# EAGLE design main_v3-przed_kompresja (EAGLE 5.10)
TME: 1206YC106KAT2A

## Sheet 1 of 6
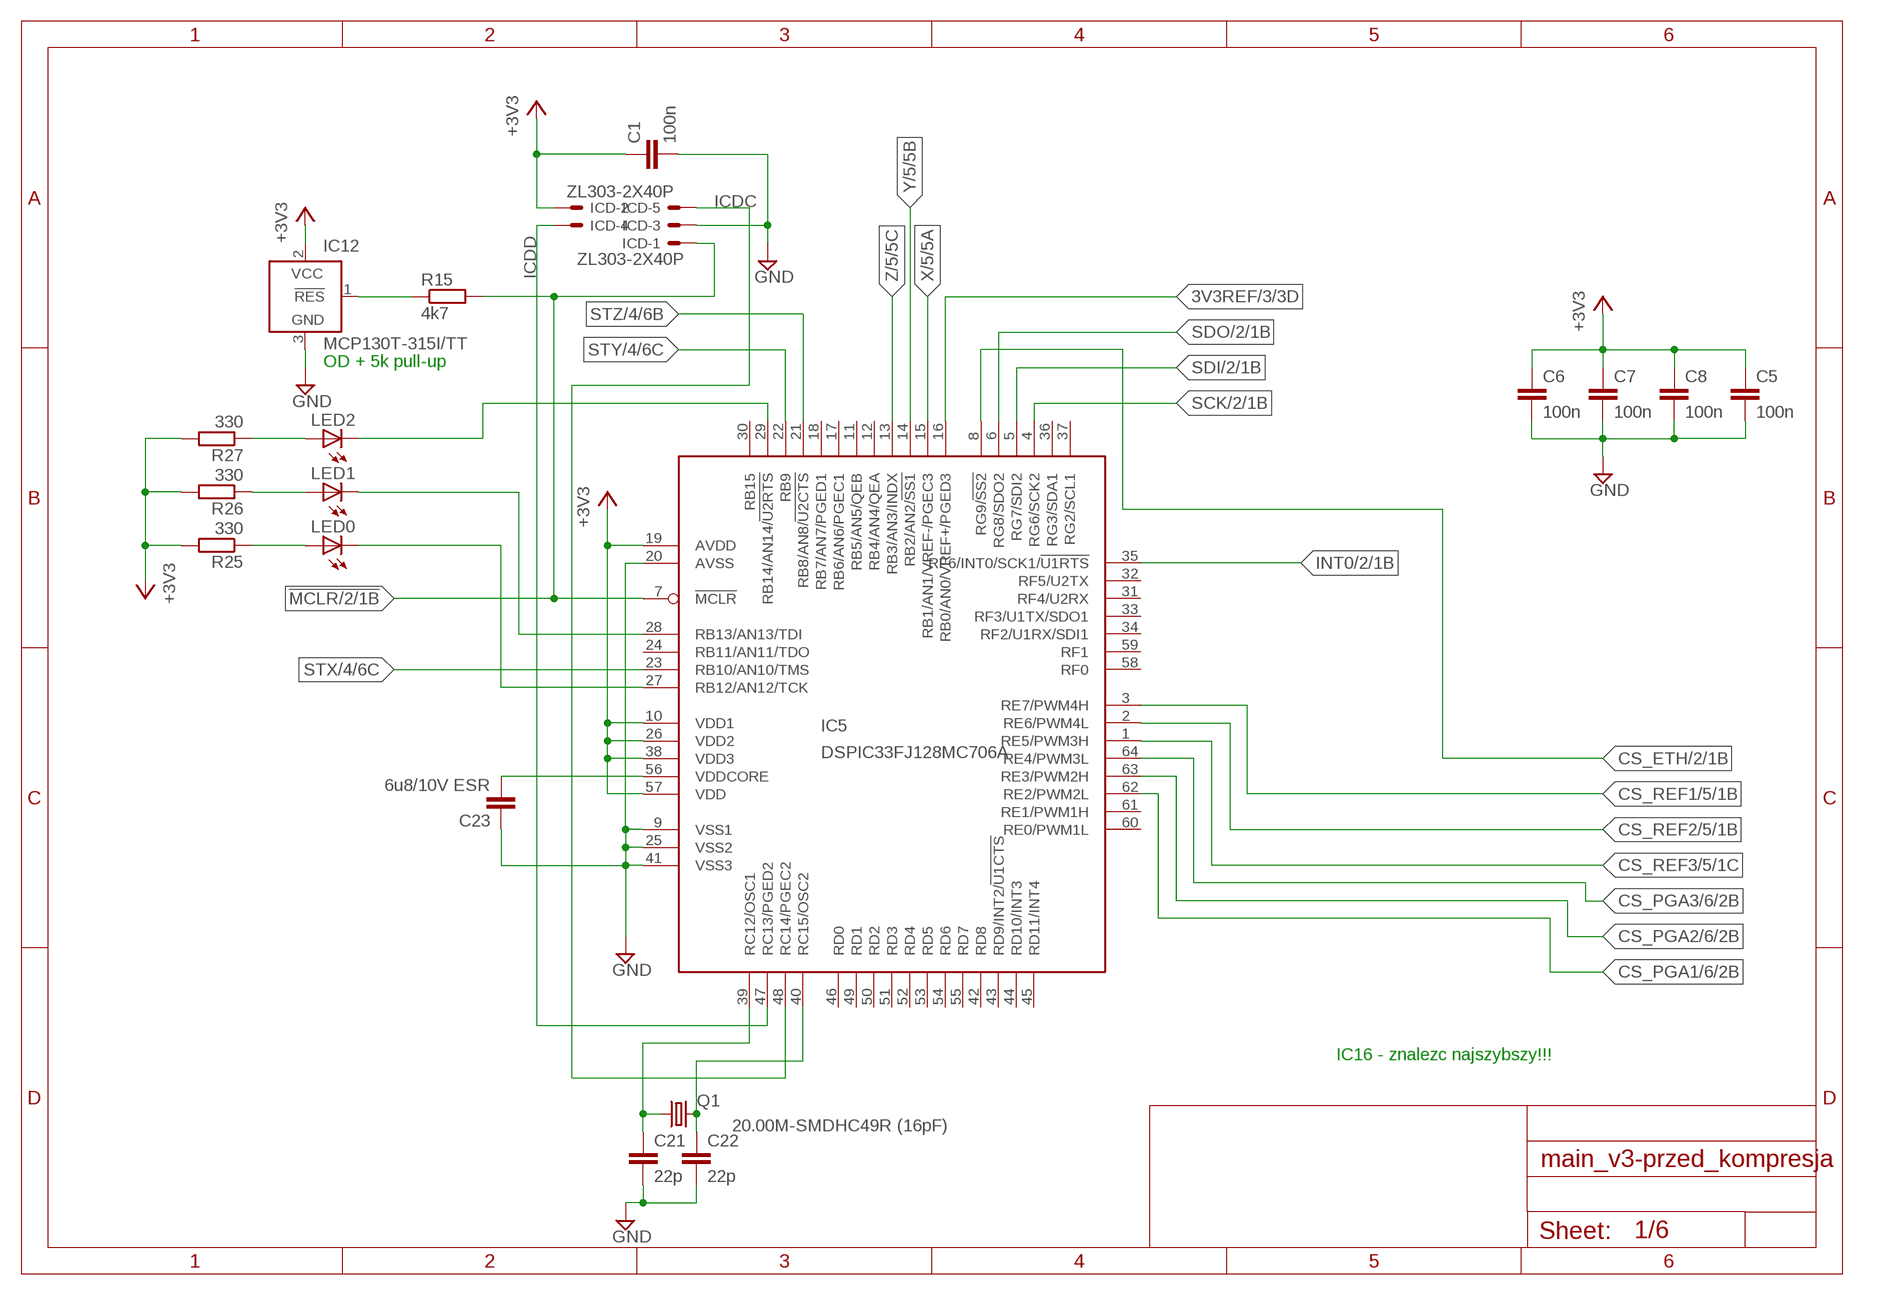
[diagram p0: schematic, sheet 1]

### Parts
C1  100n  C-EUC0805  [C0805]
C5  100n  C-EUC0805  [C0805]
C6  100n  C-EUC0805  [C0805]
C7  100n  C-EUC0805  [C0805]
C8  100n  C-EUC0805  [C0805]
C21  22p  C-EUC0805  [C0805]
C22  22p  C-EUC0805  [C0805]
C23  6u8/10V ESR  C-EUC1210  [C1210]
IC5  DSPIC33FJ128MC706A  DSPIC33FJ128MC706  [TQFP64_10X10]
IC12  MCP130T-315I/TT  MCP10T  [SOT23B-3]
ICD  ZL303-2X40P  87758-0616  [87758-0616]
LED0  LEDCHIPLED_1206  [CHIPLED_1206]
LED1  LEDCHIPLED_1206  [CHIPLED_1206]
LED2  LEDCHIPLED_1206  [CHIPLED_1206]
Q1  20.00M-SMDHC49R (16pF)  CRYSTALHC49UP  [HC49UP]
R15  4k7  R-EU_R0805  [R0805]
R25  330  R-EU_R0805  [R0805]
R26  330  R-EU_R0805  [R0805]
R27  330  R-EU_R0805  [R0805]

### Nets
3V3REF: IC5.16(RB0/AN0/VREF+/PGED3) ; also sheet 3
!MCLR: IC5.7(!MCLR) ICD.1 R15.2 ; also sheet 2
+3V3: C1.1 C5.1 C6.1 C7.1 C8.1 IC5.10(VDD1) IC5.19(AVDD) IC5.26(VDD2) IC5.38(VDD3) IC5.57(VDD) IC12.2(VCC) ICD.2 R25.2 R26.2 R27.2 ; also sheet 2,3,5
CS_ETH: IC5.8(RG9/!SS2) ; also sheet 2
CS_PGA1: IC5.62(RE2/PWM2L) ; also sheet 6
CS_PGA2: IC5.63(RE3/PWM2H) ; also sheet 6
CS_PGA3: IC5.64(RE4/PWM3L) ; also sheet 6
CS_REF1: IC5.3(RE7/PWM4H) ; also sheet 5
CS_REF2: IC5.2(RE6/PWM4L) ; also sheet 5
CS_REF3: IC5.1(RE5/PWM3H) ; also sheet 5
GND: C1.2 C5.2 C6.2 C7.2 C8.2 C21.2 C22.2 C23.1 IC5.9(VSS1) IC5.20(AVSS) IC5.25(VSS2) IC5.41(VSS3) IC12.3(GND) ICD.3 ; also sheet 2,3,6
ICDC: IC5.48(RC14/PGEC2) ICD.5
ICDD: IC5.47(RC13/PGED2) ICD.4
INT0: IC5.35(RF6/INT0/SCK1/!U1RTS) ; also sheet 2
LED0: IC5.27(RB12/AN12/TCK) LED0.C
LED1: IC5.28(RB13/AN13/TDI) LED1.C
LED2: IC5.29(RB14/AN14/!U2RTS) LED2.C
N$46: C23.2 IC5.56(VDDCORE)
N$47: IC12.1(!RES) R15.1
N$48: C22.1 IC5.40(RC15/OSC2) Q1.2
N$49: C21.1 IC5.39(RC12/OSC1) Q1.1
N$60: LED0.A R25.1
N$61: LED1.A R26.1
N$62: LED2.A R27.1
SCK: IC5.4(RG6/SCK2) ; also sheet 2,5,6
SDI: IC5.5(RG7/SDI2) ; also sheet 2
SDO: IC5.6(RG8/SDO2) ; also sheet 2,5,6
STX: IC5.23(RB10/AN10/TMS) ; also sheet 4
STY: IC5.22(RB9) ; also sheet 4
STZ: IC5.21(RB8/AN8/!U2CTS) ; also sheet 4
X: IC5.15(RB1/AN1/VREF-/PGEC3) ; also sheet 5
Y: IC5.14(RB2/AN2/!SS1) ; also sheet 5
Z: IC5.13(RB3/AN3/INDX) ; also sheet 5
Unconnected: IC5.11(RB5/AN5/QEB) IC5.12(RB4/AN4/QEA) IC5.17(RB6/AN6/PGEC1) IC5.18(RB7/AN7/PGED1) IC5.24(RB11/AN11/TDO) IC5.30(RB15) IC5.31(RF4/U2RX) IC5.32(RF5/U2TX) IC5.33(RF3/U1TX/SDO1) IC5.34(RF2/U1RX/SDI1) IC5.36(RG3/SDA1) IC5.37(RG2/SCL1) IC5.42(RD8) IC5.43(RD9/INT2/!U1CTS) IC5.44(RD10/INT3) IC5.45(RD11/INT4) IC5.46(RD0) IC5.49(RD1) IC5.50(RD2) IC5.51(RD3) IC5.52(RD4) IC5.53(RD5) IC5.54(RD6) IC5.55(RD7) IC5.58(RF0) IC5.59(RF1) IC5.60(RE0/PWM1L) IC5.61(RE1/PWM1H) ICD.6

### Notes on the sheet
- OD + 5k pull-up
- IC16 - znalezc najszybszy!!!

## Sheet 2 of 6
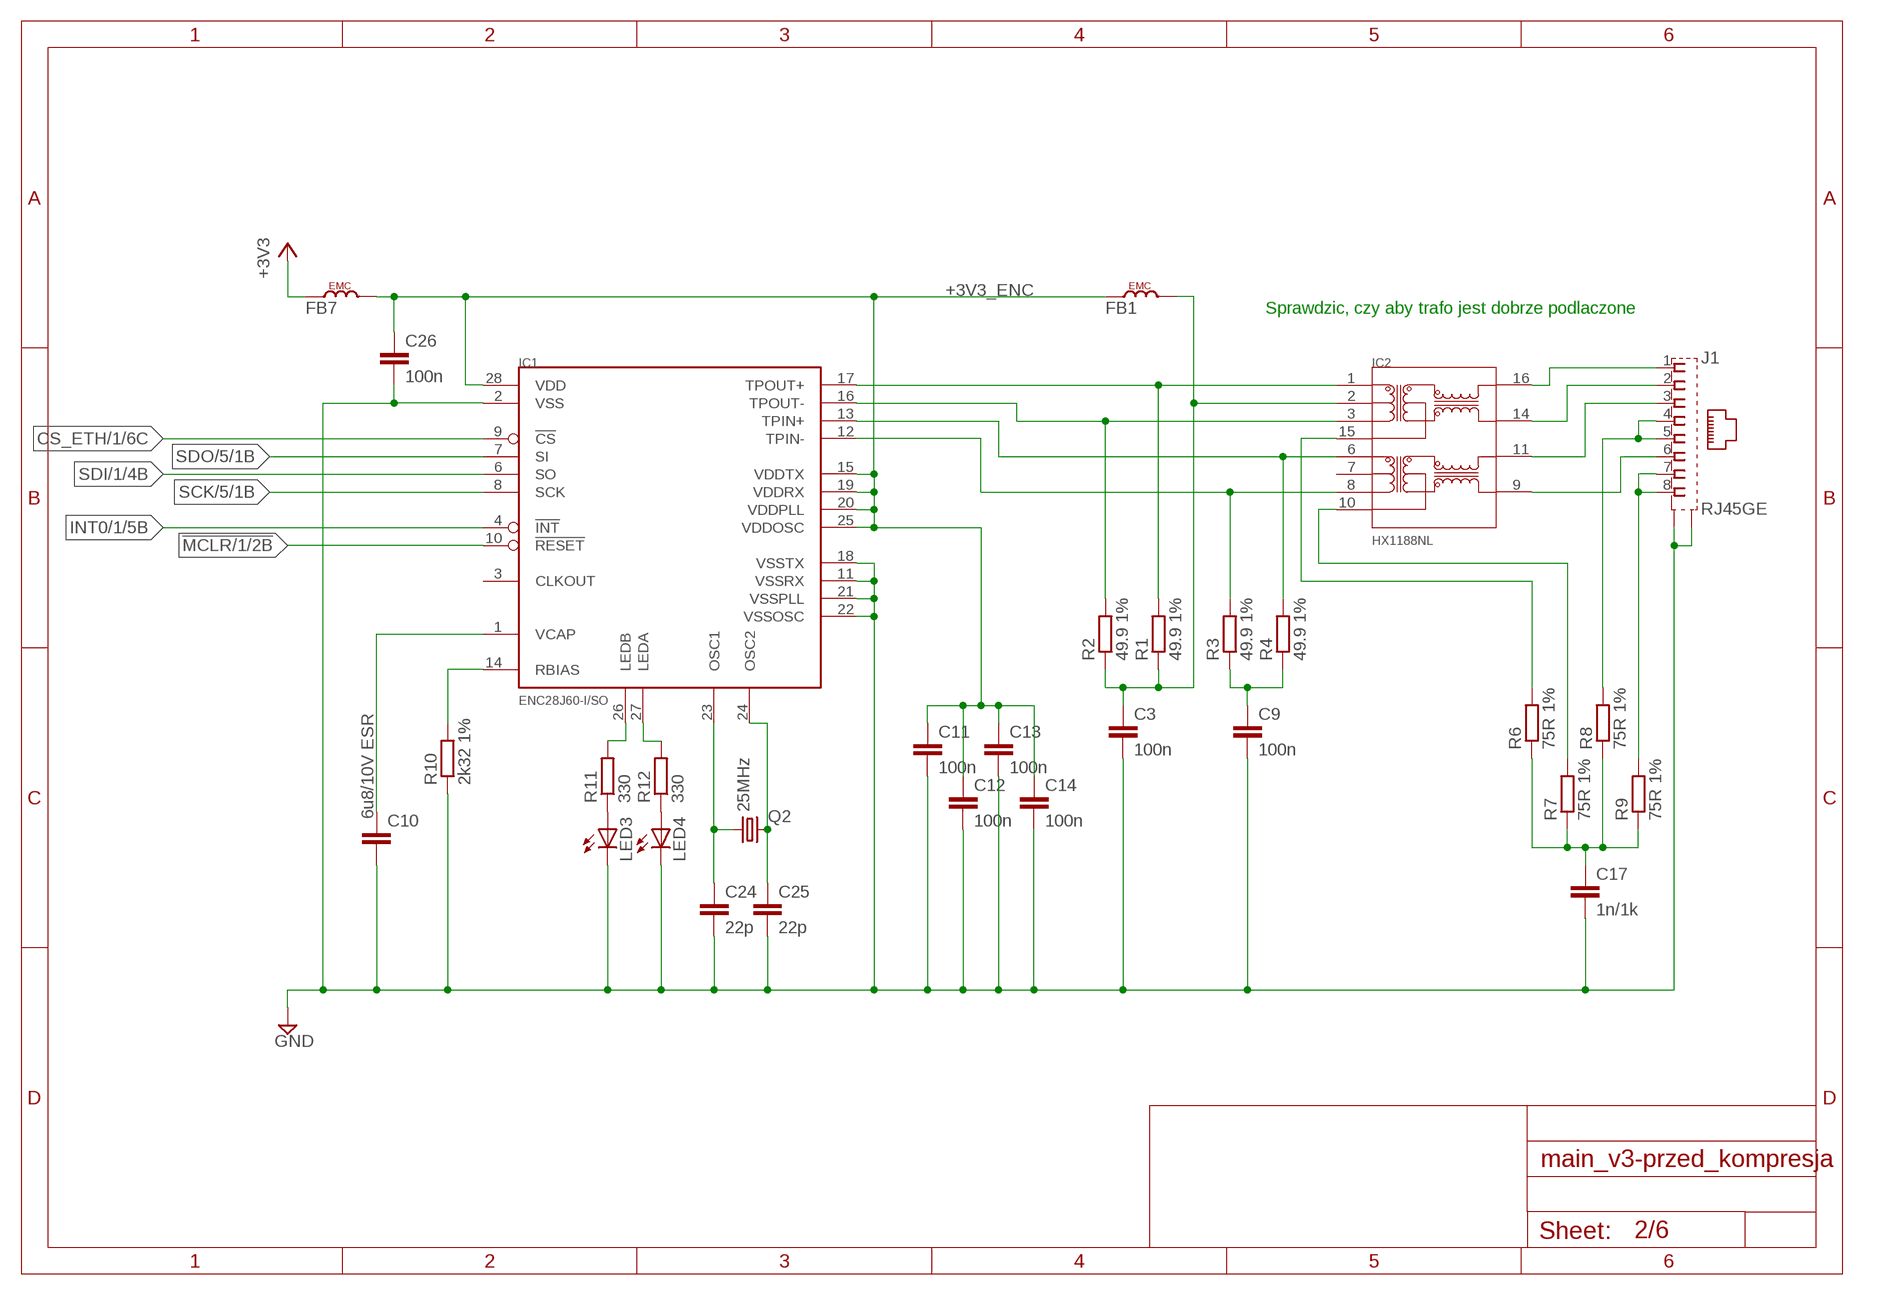
[diagram p1: schematic, sheet 2]

### Parts
C3  100n  C-EUC0805  [C0805]
C9  100n  C-EUC0805  [C0805]
C10  6u8/10V ESR  C-EUC1210  [C1210]
C11  100n  C-EUC0805  [C0805]
C12  100n  C-EUC0805  [C0805]
C13  100n  C-EUC0805  [C0805]
C14  100n  C-EUC0805  [C0805]
C17  1n/1k  C-EUC0805  [C0805]
C24  22p  C-EUC0805  [C0805]
C25  22p  C-EUC0805  [C0805]
C26  100n  C-EUC0805  [C0805]
FB1  FERRITE_BEAD0805  [R0805]
FB7  FERRITE_BEAD0805  [R0805]
IC1  ENC28J60-I/SO  [SO28W]
IC2  HX1188NL  [TRAFO_H*NL]
J1  RJ45GE  555153-1  [555153-1]
LED3  LEDCHIPLED_1206  [CHIPLED_1206]
LED4  LEDCHIPLED_1206  [CHIPLED_1206]
Q2  25MHz  CRYSTALHC49UP  [HC49UP]
R1  49.9 1%  R-EU_M0805  [M0805]
R2  49.9 1%  R-EU_M0805  [M0805]
R3  49.9 1%  R-EU_M0805  [M0805]
R4  49.9 1%  R-EU_M0805  [M0805]
R6  75R 1%  R-EU_R0805  [R0805]
R7  75R 1%  R-EU_R0805  [R0805]
R8  75R 1%  R-EU_R0805  [R0805]
R9  75R 1%  R-EU_R0805  [R0805]
R10  2k32 1%  R-EU_R1206  [R1206]
R11  330  R-EU_R0805  [R0805]
R12  330  R-EU_R0805  [R0805]

### Nets
!MCLR: IC1.10(!RESET) ; also sheet 1
+3V3: FB7.1 ; also sheet 1,3,5
+3V3_ENC: C11.1 C12.1 C13.1 C14.1 C26.1 FB1.1 FB7.2 IC1.15(VDDTX) IC1.19(VDDRX) IC1.20(VDDPLL) IC1.25(VDDOSC) IC1.28(VDD)
CS_ETH: IC1.9(!CS) ; also sheet 1
GND: C3.2 C9.2 C10.2 C11.2 C12.2 C13.2 C14.2 C17.2 C24.2 C25.2 C26.2 IC1.2(VSS) IC1.11(VSSRX) IC1.18(VSSTX) IC1.21(VSSPLL) IC1.22(VSSOSC) J1.G1(S1) J1.G2(S2) LED3.C LED4.C R10.1 ; also sheet 1,3,6
INT0: IC1.4(!INT) ; also sheet 1
N$5: IC2.15 R6.2
N$6: C3.1 FB1.2 IC2.2 R1.1 R2.1
N$7: IC2.10 R7.2
N$8: C9.1 R3.1 R4.1
N$9: C17.1 R6.1 R7.1 R8.1 R9.1
N$14: J1.4 J1.5 R8.2
N$15: J1.7 J1.8 R9.2
N$16: C25.1 IC1.24(OSC2) Q2.2
N$17: C24.1 IC1.23(OSC1) Q2.1
N$18: IC1.14(RBIAS) R10.2
N$19: C10.1 IC1.1(VCAP)
N$22: LED3.A R11.1
N$23: LED4.A R12.1
N$24: IC1.26(LEDB) R11.2
N$25: IC1.27(LEDA) R12.2
SCK: IC1.8(SCK) ; also sheet 1,5,6
SDI: IC1.6(SO) ; also sheet 1
SDO: IC1.7(SI) ; also sheet 1,5,6
TPIN+1: IC1.13(TPIN+) IC2.6 R4.2
TPIN+2: IC2.11 J1.3
TPIN-1: IC1.12(TPIN-) IC2.8 R3.2
TPIN-2: IC2.9 J1.6
TPOUT+1: IC1.17(TPOUT+) IC2.1 R1.2
TPOUT+2: IC2.16 J1.1
TPOUT-1: IC1.16(TPOUT-) IC2.3 R2.2
TPOUT-2: IC2.14 J1.2
Unconnected: IC1.3(CLKOUT) IC2.7

### Notes on the sheet
- Sprawdzic, czy aby trafo jest dobrze podlaczone

## Sheet 3 of 6
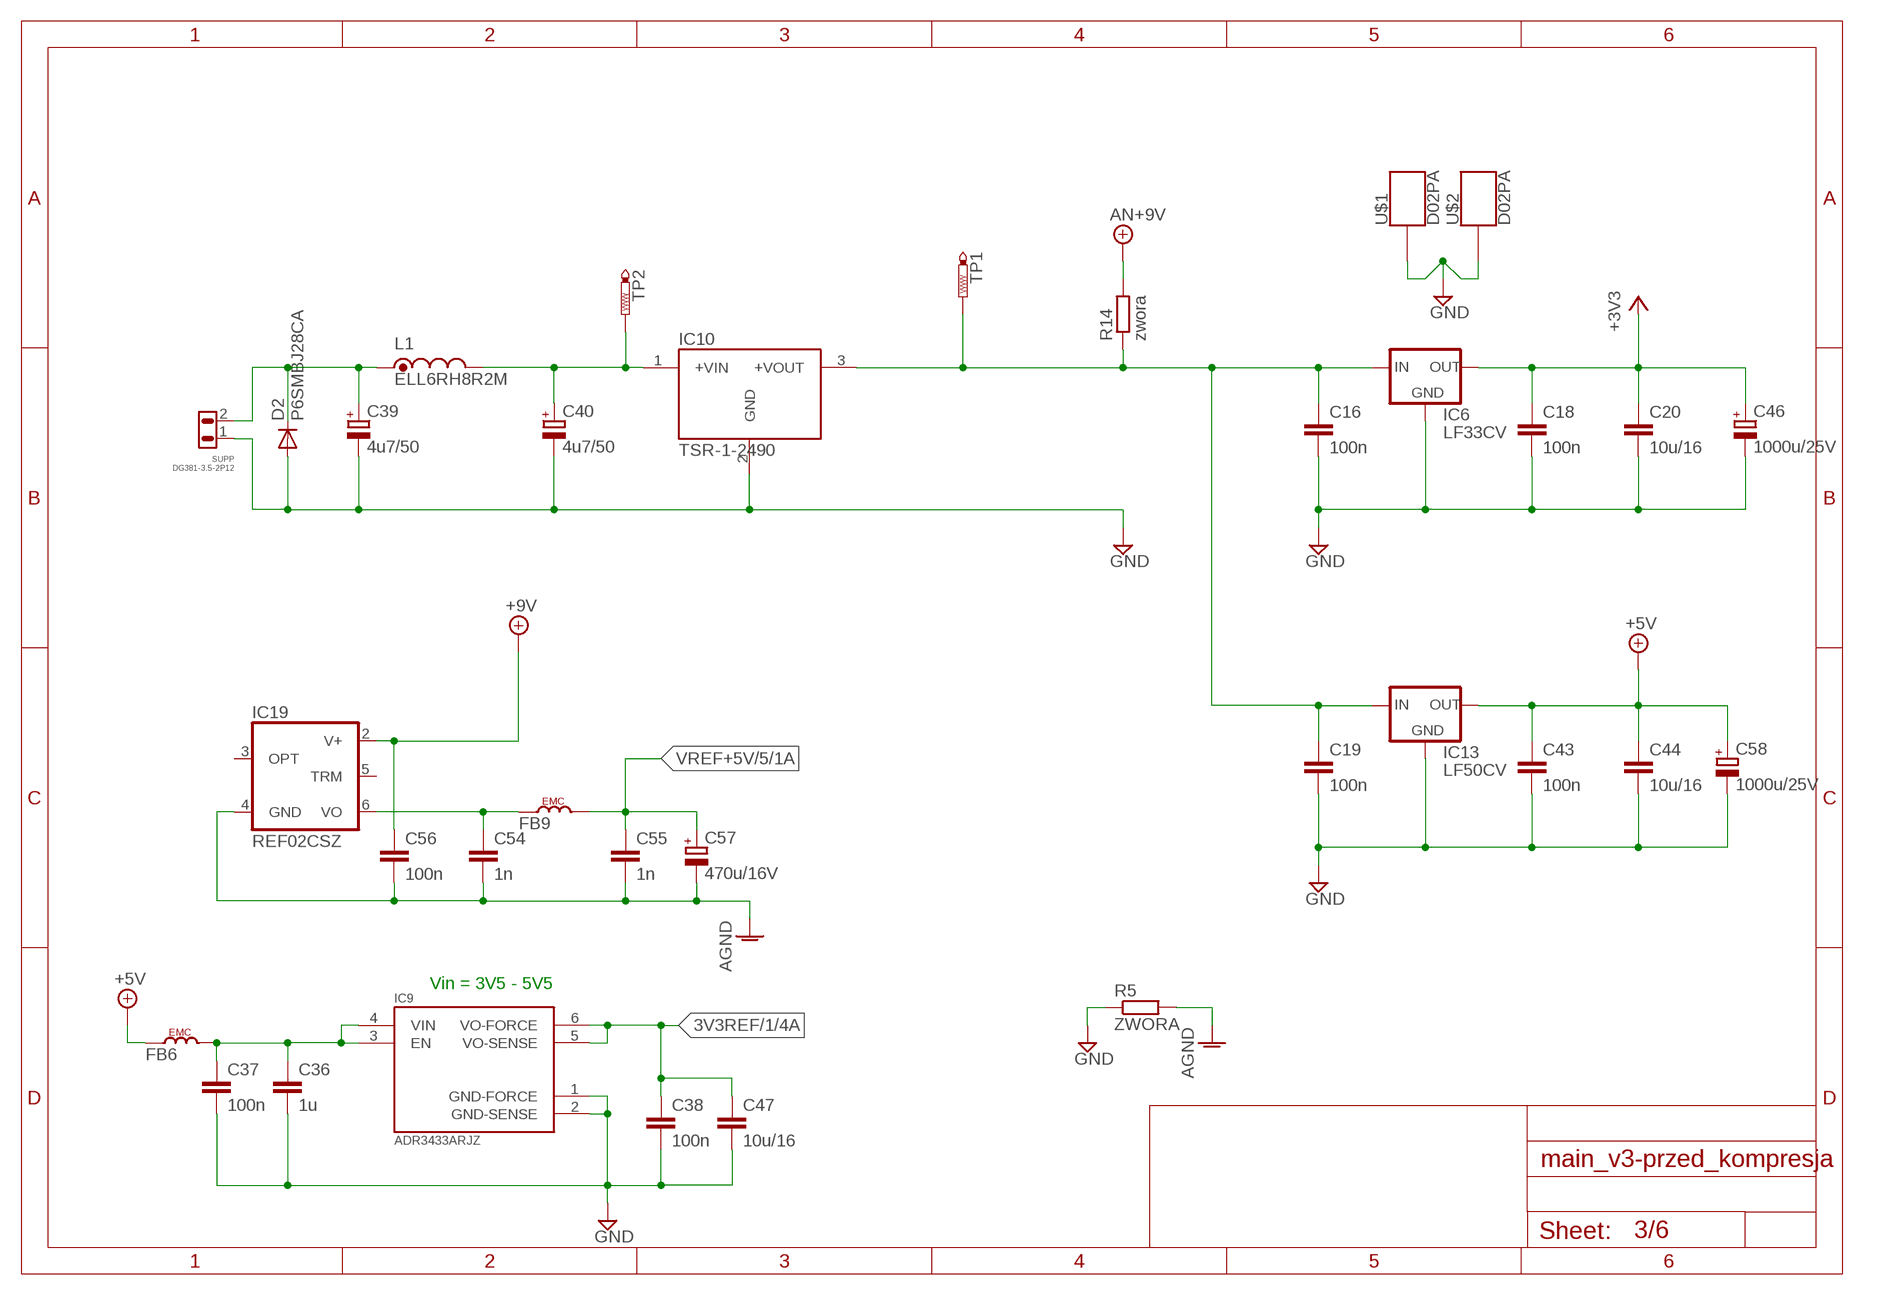
[diagram p2: schematic, sheet 3]

### Parts
C16  100n  C-EUC0805  [C0805]
C18  100n  C-EUC0805  [C0805]
C19  100n  C-EUC0805  [C0805]
C20  10u/16  C-EUC1206K  [C1206K]
C36  1u  C-EUC1206  [C1206]
C37  100n  C-EUC0805  [C0805]
C38  100n  C-EUC0805  [C0805]
C39  4u7/50  CPOL-EUUD-5X5,8  [UD-5X5,8_NICHICON]
C40  4u7/50  CPOL-EUUD-5X5,8  [UD-5X5,8_NICHICON]
C43  100n  C-EUC0805  [C0805]
C44  10u/16  C-EUC1206K  [C1206K]
C46  1000u/25V  CPOL-EUTT5D10  [TT5D10]
C47  10u/16  C-EUC1206K  [C1206K]
C54  1n  C-EUC0805  [C0805]
C55  1n  C-EUC0805  [C0805]
C56  100n  C-EUC0805  [C0805]
C57  470u/16V  CPOL-EUE3.5-8  [E3,5-8]
C58  1000u/25V  CPOL-EUTT5D10  [TT5D10]
D2  P6SMBJ28CA  DIODE-DO214AA  [DO214AA]
FB6  FERRITE_BEAD0805  [R0805]
FB9  FERRITE_BEAD0805  [R0805]
IC6  LF33CV  78XXS  [78XXS]
IC9  ADR3433ARJZ  [SOT23-6]
IC10  TSR-1-2490  [TSR1]
IC13  LF50CV  78XXS  [78XXS]
IC19  REF02CSZ  REF02D  [SO08]
L1  ELL6RH8R2M  [L_PKG_60X60]
R5  ZWORA  R-EU_M1206  [M1206]
R14  zwora  R-EU_M1206  [M1206]
SUPP  DG381-3.5-2P12  DG318-3.5-2P  [DG381X2-3.5]
TP1  PTR1PAD1-13  [P1-13]
TP2  PTR1PAD1-13  [P1-13]
U$1  D02PA  [D02PA]
U$2  D02PA  [D02PA]

### Nets
3V3REF: C38.1 C47.1 IC9.5(VO-SENSE) IC9.6(VO-FORCE) ; also sheet 1
+3V3: C18.1 C20.1 C46.+ IC6.OUT ; also sheet 1,2,5
+5V: C43.1 C44.1 C58.+ FB6.1 IC13.OUT ; also sheet 5
AGND: C54.2 C55.2 C56.2 C57.- IC19.4(GND) R5.2 ; also sheet 4,5
AN+9V: C56.1 IC19.2(V+) R14.2 ; supply symbol labelled +9V ; also sheet 4
GND: C16.2 C18.2 C19.2 C20.2 C36.2 C37.2 C38.2 C39.- C40.- C43.2 C44.2 C46.- C47.2 C58.- D2.A IC6.GND IC9.1(GND-FORCE) IC9.2(GND-SENSE) IC10.2(GND) IC13.GND R5.1 SUPP.1 U$1.P$1 U$2.P$1 ; also sheet 1,2,6
N$12: C36.1 C37.1 FB6.2 IC9.3(EN) IC9.4(VIN)
N$13: C54.1 FB9.1 IC19.6(VO)
N$30: C16.1 C19.1 IC6.IN IC10.3(+VOUT) IC13.IN R14.1 TP1.TP
N$35: C40.+ IC10.1(+VIN) L1.2(OUT) TP2.TP
N$41: C39.+ D2.C L1.1(IN) SUPP.2
VREF+5V: C55.1 C57.+ FB9.2 ; also sheet 5
Unconnected: IC19.3(OPT) IC19.5(TRM)

### Notes on the sheet
- Vin = 3V5 - 5V5

## Sheet 4 of 6
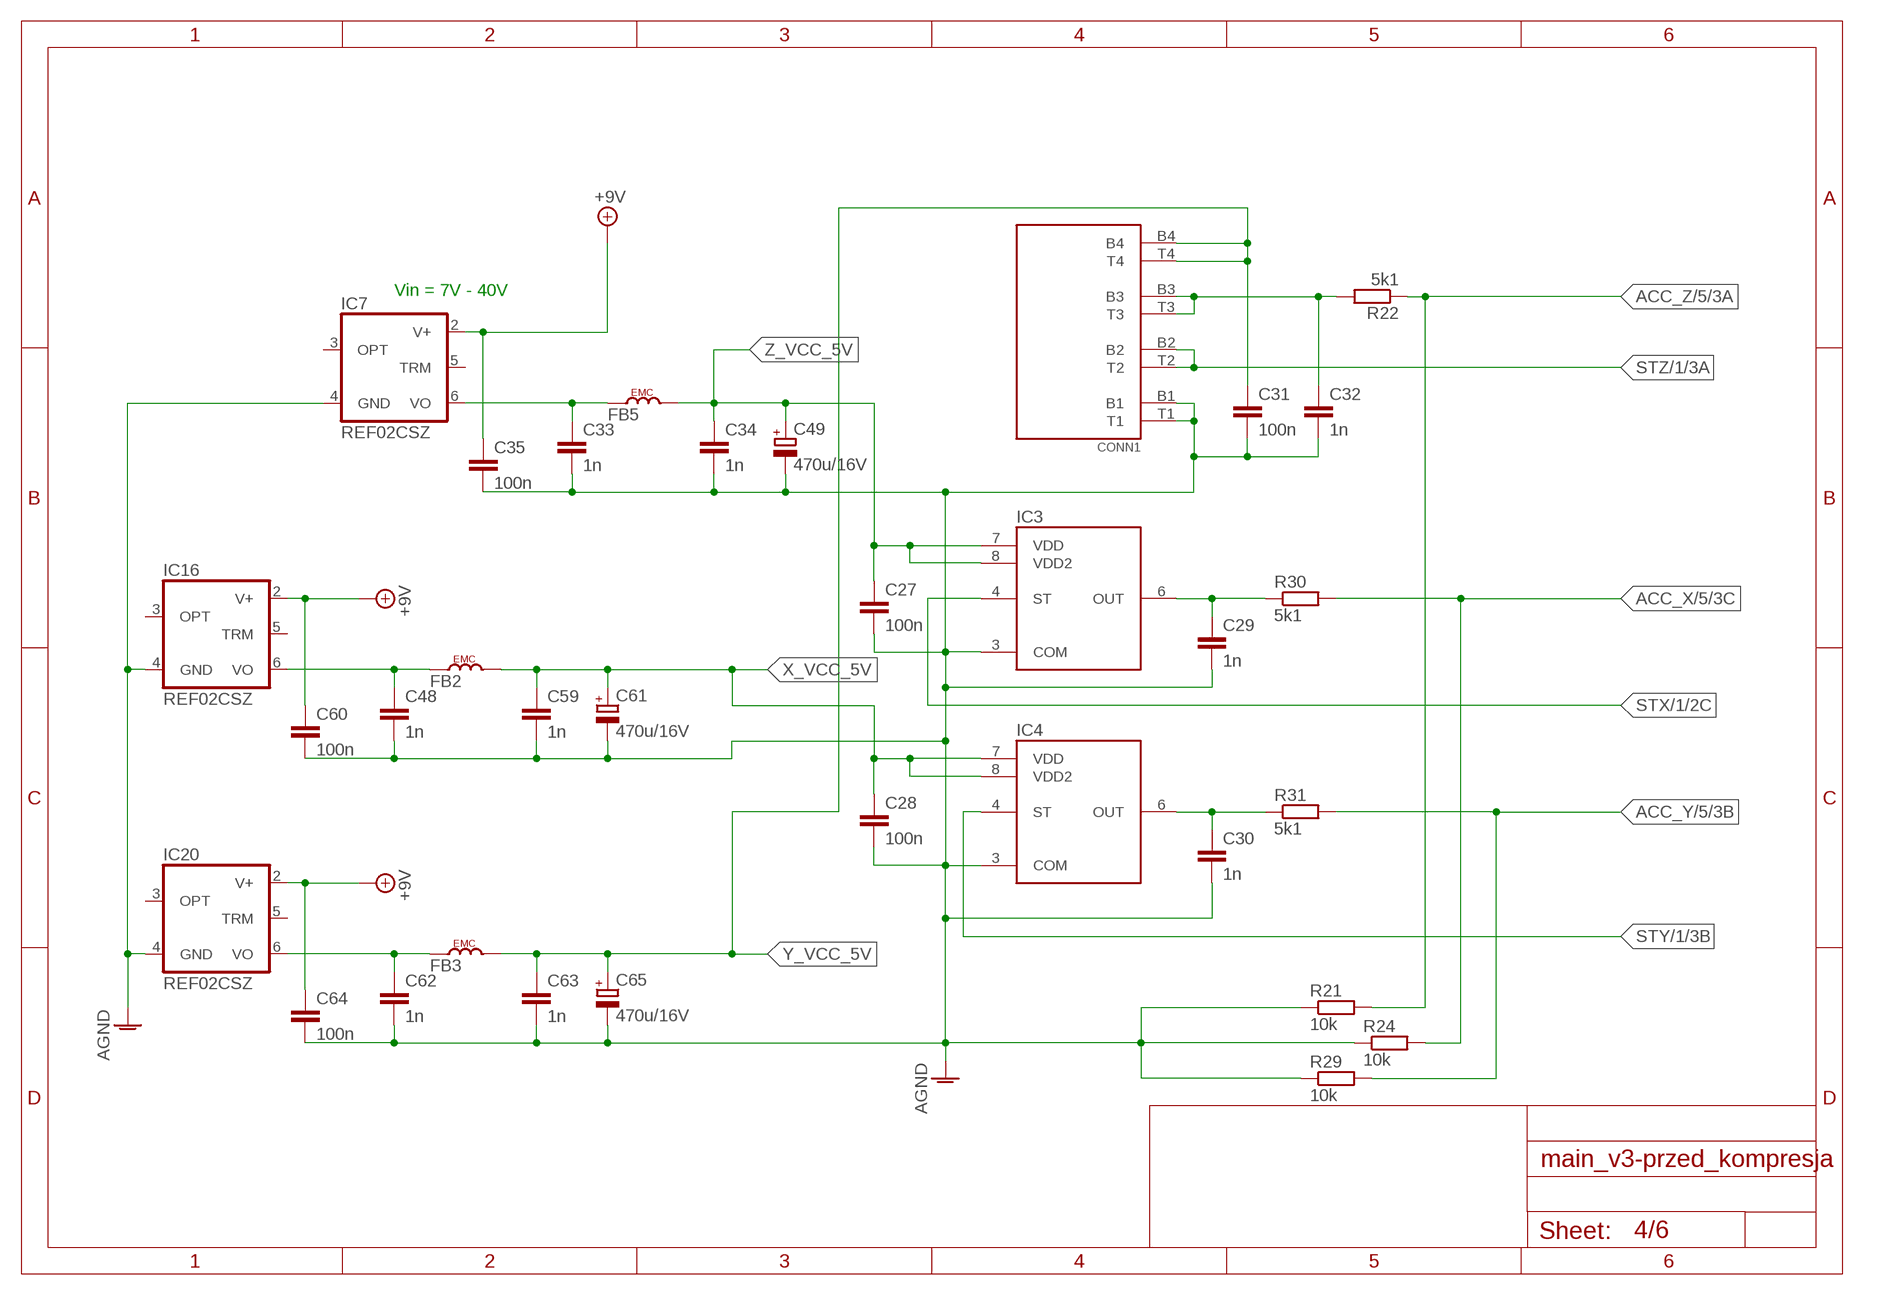
[diagram p3: schematic, sheet 4]

### Parts
C27  100n  C-EUC0805  [C0805]
C28  100n  C-EUC0805  [C0805]
C29  1n  C-EUC0805  [C0805]
C30  1n  C-EUC0805  [C0805]
C31  100n  C-EUC0805  [C0805]
C32  1n  C-EUC0805  [C0805]
C33  1n  C-EUC0805  [C0805]
C34  1n  C-EUC0805  [C0805]
C35  100n  C-EUC0805  [C0805]
C48  1n  C-EUC0805  [C0805]
C49  470u/16V  CPOL-EUE3.5-8  [E3,5-8]
C59  1n  C-EUC0805  [C0805]
C60  100n  C-EUC0805  [C0805]
C61  470u/16V  CPOL-EUE3.5-8  [E3,5-8]
C62  1n  C-EUC0805  [C0805]
C63  1n  C-EUC0805  [C0805]
C64  100n  C-EUC0805  [C0805]
C65  470u/16V  CPOL-EUE3.5-8  [E3,5-8]
CONN1  GNIAZDO4  [GNIAZDO]
FB2  FERRITE_BEAD0805  [R0805]
FB3  FERRITE_BEAD0805  [R0805]
FB5  FERRITE_BEAD0805  [R0805]
IC3  ADXL001-70L  [LCC8_LONG]
IC4  ADXL001-70L  [LCC8_LONG]
IC7  REF02CSZ  REF02D  [SO08]
IC16  REF02CSZ  REF02D  [SO08]
IC20  REF02CSZ  REF02D  [SO08]
R21  10k  R-EU_M0805  [M0805]
R22  5k1  R-EU_M0805  [M0805]
R24  10k  R-EU_M0805  [M0805]
R29  10k  R-EU_M0805  [M0805]
R30  5k1  R-EU_M0805  [M0805]
R31  5k1  R-EU_M0805  [M0805]

### Nets
ACC_X: R24.2 R30.2 ; also sheet 5
ACC_Y: R29.2 R31.2 ; also sheet 5
ACC_Z: R21.2 R22.1 ; also sheet 5
AGND: C27.2 C28.2 C29.2 C30.2 C31.2 C32.2 C33.2 C34.2 C35.2 C48.2 C49.- C59.2 C60.2 C61.- C62.2 C63.2 C64.2 C65.- CONN1.B1 CONN1.T1 IC3.3(COM) IC4.3(COM) IC7.4(GND) IC16.4(GND) IC20.4(GND) R21.1 R24.1 R29.1 ; also sheet 3,5
AN+9V: C35.1 C60.1 C64.1 IC7.2(V+) IC16.2(V+) IC20.2(V+) ; supply symbol labelled +9V ; also sheet 3
N$3: C48.1 FB2.1 IC16.6(VO)
N$4: C62.1 FB3.1 IC20.6(VO)
N$26: C29.1 IC3.6(OUT) R30.1
N$27: C30.1 IC4.6(OUT) R31.1
N$29: C32.1 CONN1.B3 CONN1.T3 R22.2
N$34: C33.1 FB5.1 IC7.6(VO)
STX: IC3.4(ST) ; also sheet 1
STY: IC4.4(ST) ; also sheet 1
STZ: CONN1.B2 CONN1.T2 ; also sheet 1
X_VCC_5V: C28.1 C59.1 C61.+ FB2.2 IC4.7(VDD) IC4.8(VDD2)
Y_VCC_5V: C31.1 C63.1 C65.+ CONN1.B4 CONN1.T4 FB3.2
Z_VCC_5V: C27.1 C34.1 C49.+ FB5.2 IC3.7(VDD) IC3.8(VDD2)
Unconnected: IC7.3(OPT) IC7.5(TRM) IC16.3(OPT) IC16.5(TRM) IC20.3(OPT) IC20.5(TRM)

### Notes on the sheet
- Vin = 7V - 40V

## Sheet 5 of 6
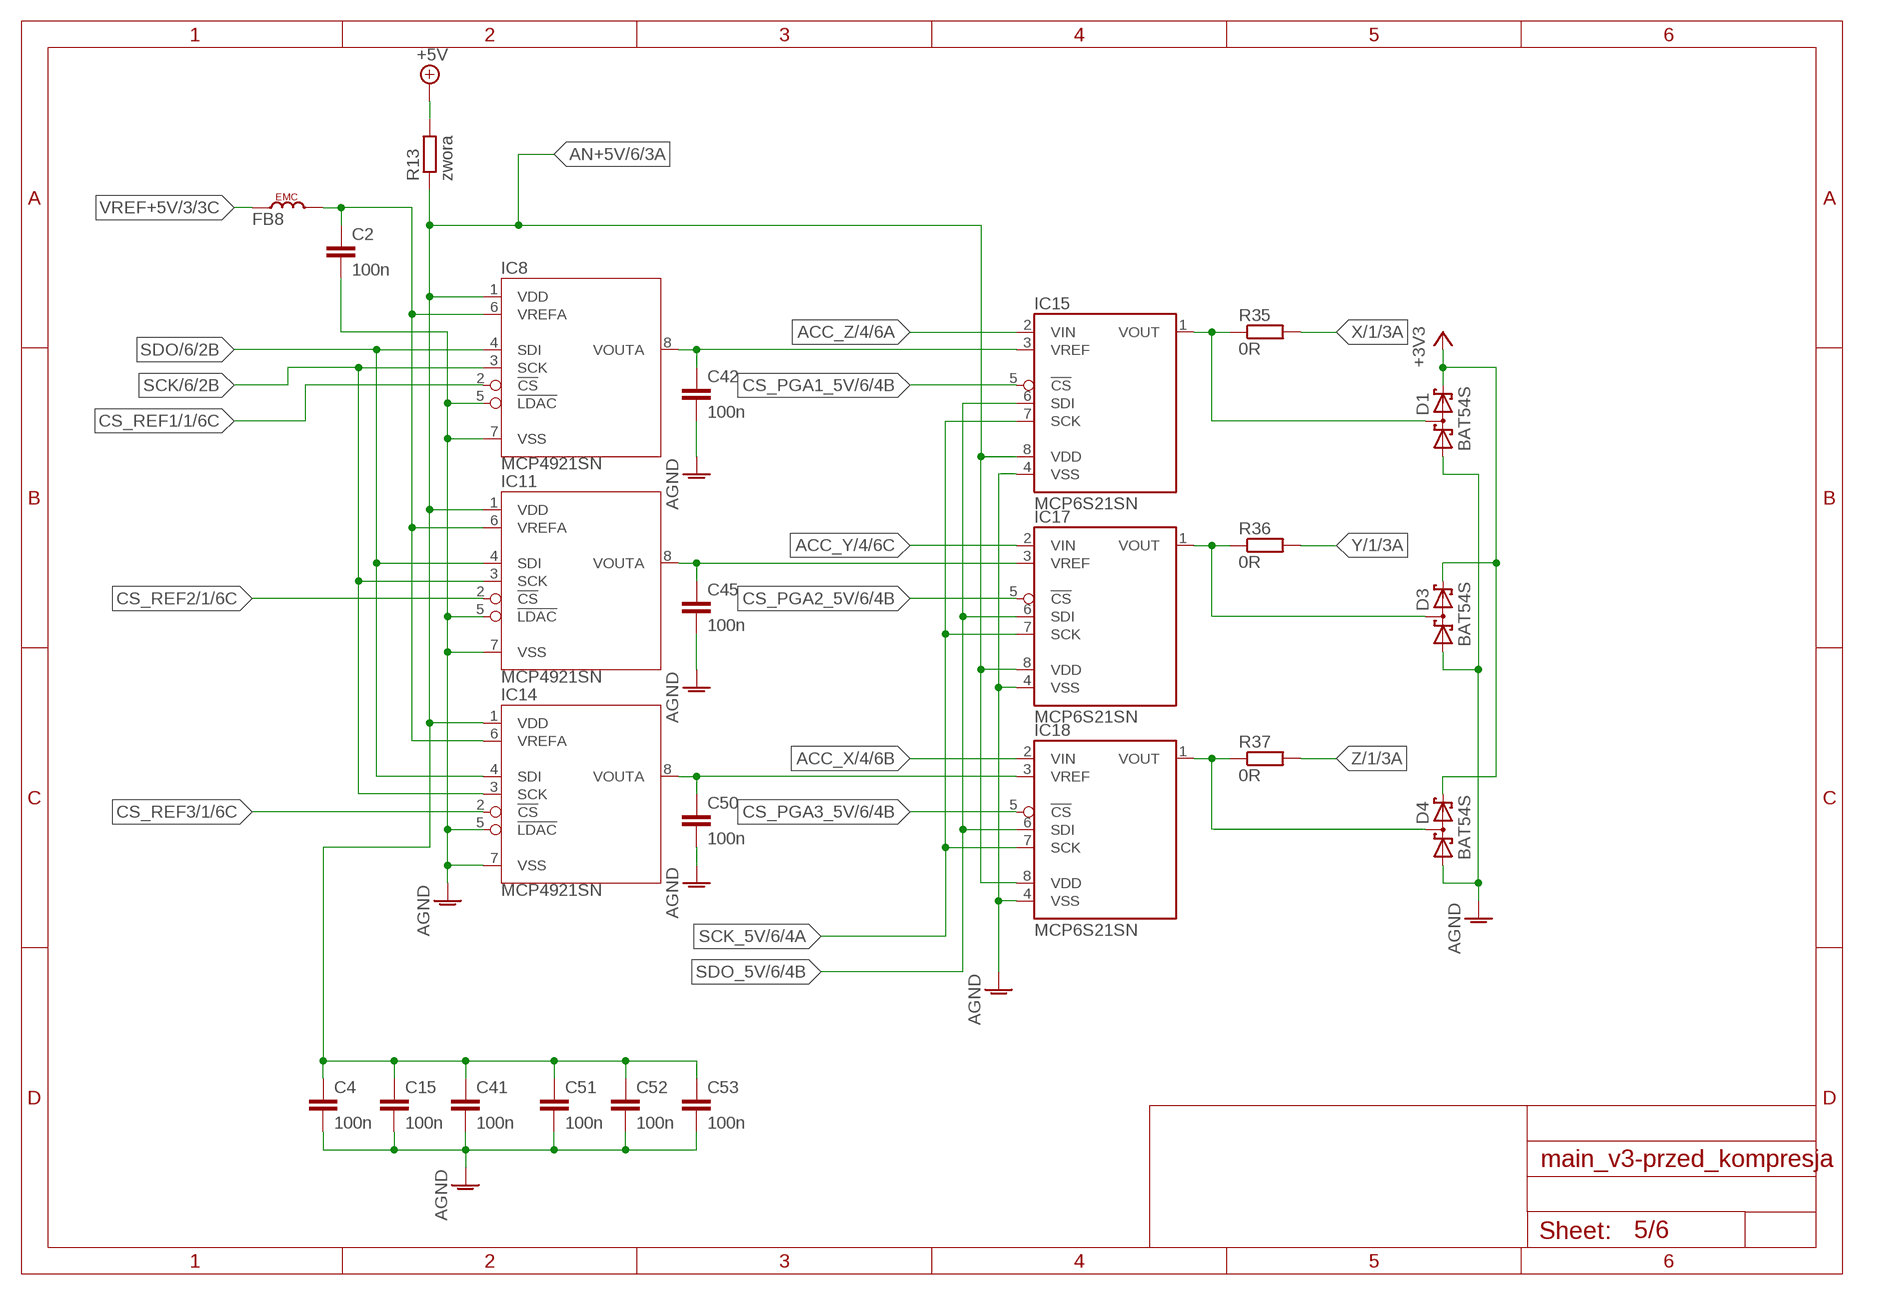
[diagram p4: schematic, sheet 5]

### Parts
C2  100n  C-EUC0805  [C0805]
C4  100n  C-EUC0805  [C0805]
C15  100n  C-EUC0805  [C0805]
C41  100n  C-EUC0805  [C0805]
C42  100n  C-EUC0805  [C0805]
C45  100n  C-EUC0805  [C0805]
C50  100n  C-EUC0805  [C0805]
C51  100n  C-EUC0805  [C0805]
C52  100n  C-EUC0805  [C0805]
C53  100n  C-EUC0805  [C0805]
D1  BAT54S  [SOT23]
D3  BAT54S  [SOT23]
D4  BAT54S  [SOT23]
FB8  FERRITE_BEAD0805  [R0805]
IC8  MCP4921SN  [SO-08]
IC11  MCP4921SN  [SO-08]
IC14  MCP4921SN  [SO-08]
IC15  MCP6S21SN  [SOIC8]
IC17  MCP6S21SN  [SOIC8]
IC18  MCP6S21SN  [SOIC8]
R13  zwora  R-EU_M1206  [M1206]
R35  0R  R-EU_M0805  [M0805]
R36  0R  R-EU_M0805  [M0805]
R37  0R  R-EU_M0805  [M0805]

### Nets
+3V3: D1.2(C2) D3.2(C2) D4.2(C2) ; also sheet 1,2,3
+5V: R13.2 ; also sheet 3
ACC_X: IC18.2(VIN) ; also sheet 4
ACC_Y: IC17.2(VIN) ; also sheet 4
ACC_Z: IC15.2(VIN) ; also sheet 4
AGND: C2.2 C4.2 C15.2 C41.2 C42.2 C45.2 C50.2 C51.2 C52.2 C53.2 D1.1(A1) D3.1(A1) D4.1(A1) IC8.5(!LDAC) IC8.7(VSS) IC11.5(!LDAC) IC11.7(VSS) IC14.5(!LDAC) IC14.7(VSS) IC15.4(VSS) IC17.4(VSS) IC18.4(VSS) ; also sheet 3,4
AN+5V: C4.1 C15.1 C41.1 C51.1 C52.1 C53.1 IC8.1(VDD) IC11.1(VDD) IC14.1(VDD) IC15.8(VDD) IC17.8(VDD) IC18.8(VDD) R13.1 ; also sheet 6
CS_PGA1_5V: IC15.5(!CS) ; also sheet 6
CS_PGA2_5V: IC17.5(!CS) ; also sheet 6
CS_PGA3_5V: IC18.5(!CS) ; also sheet 6
CS_REF1: IC8.2(!CS) ; also sheet 1
CS_REF2: IC11.2(!CS) ; also sheet 1
CS_REF3: IC14.2(!CS) ; also sheet 1
N$1: C42.1 IC8.8(VOUTA) IC15.3(VREF)
N$2: C45.1 IC11.8(VOUTA) IC17.3(VREF)
N$11: C2.1 FB8.2 IC8.6(VREFA) IC11.6(VREFA) IC14.6(VREFA)
N$20: C50.1 IC14.8(VOUTA) IC18.3(VREF)
SCK: IC8.3(SCK) IC11.3(SCK) IC14.3(SCK) ; also sheet 1,2,6
SCK_5V: IC15.7(SCK) IC17.7(SCK) IC18.7(SCK) ; also sheet 6
SDO: IC8.4(SDI) IC11.4(SDI) IC14.4(SDI) ; also sheet 1,2,6
SDO_5V: IC15.6(SDI) IC17.6(SDI) IC18.6(SDI) ; also sheet 6
VREF+5V: FB8.1 ; also sheet 3
X: R35.2 ; also sheet 1
XAMP: D1.3(C1A2) IC15.1(VOUT) R35.1
Y: R36.2 ; also sheet 1
YAMP: D3.3(C1A2) IC17.1(VOUT) R36.1
Z: R37.2 ; also sheet 1
ZAMP: D4.3(C1A2) IC18.1(VOUT) R37.1

## Sheet 6 of 6
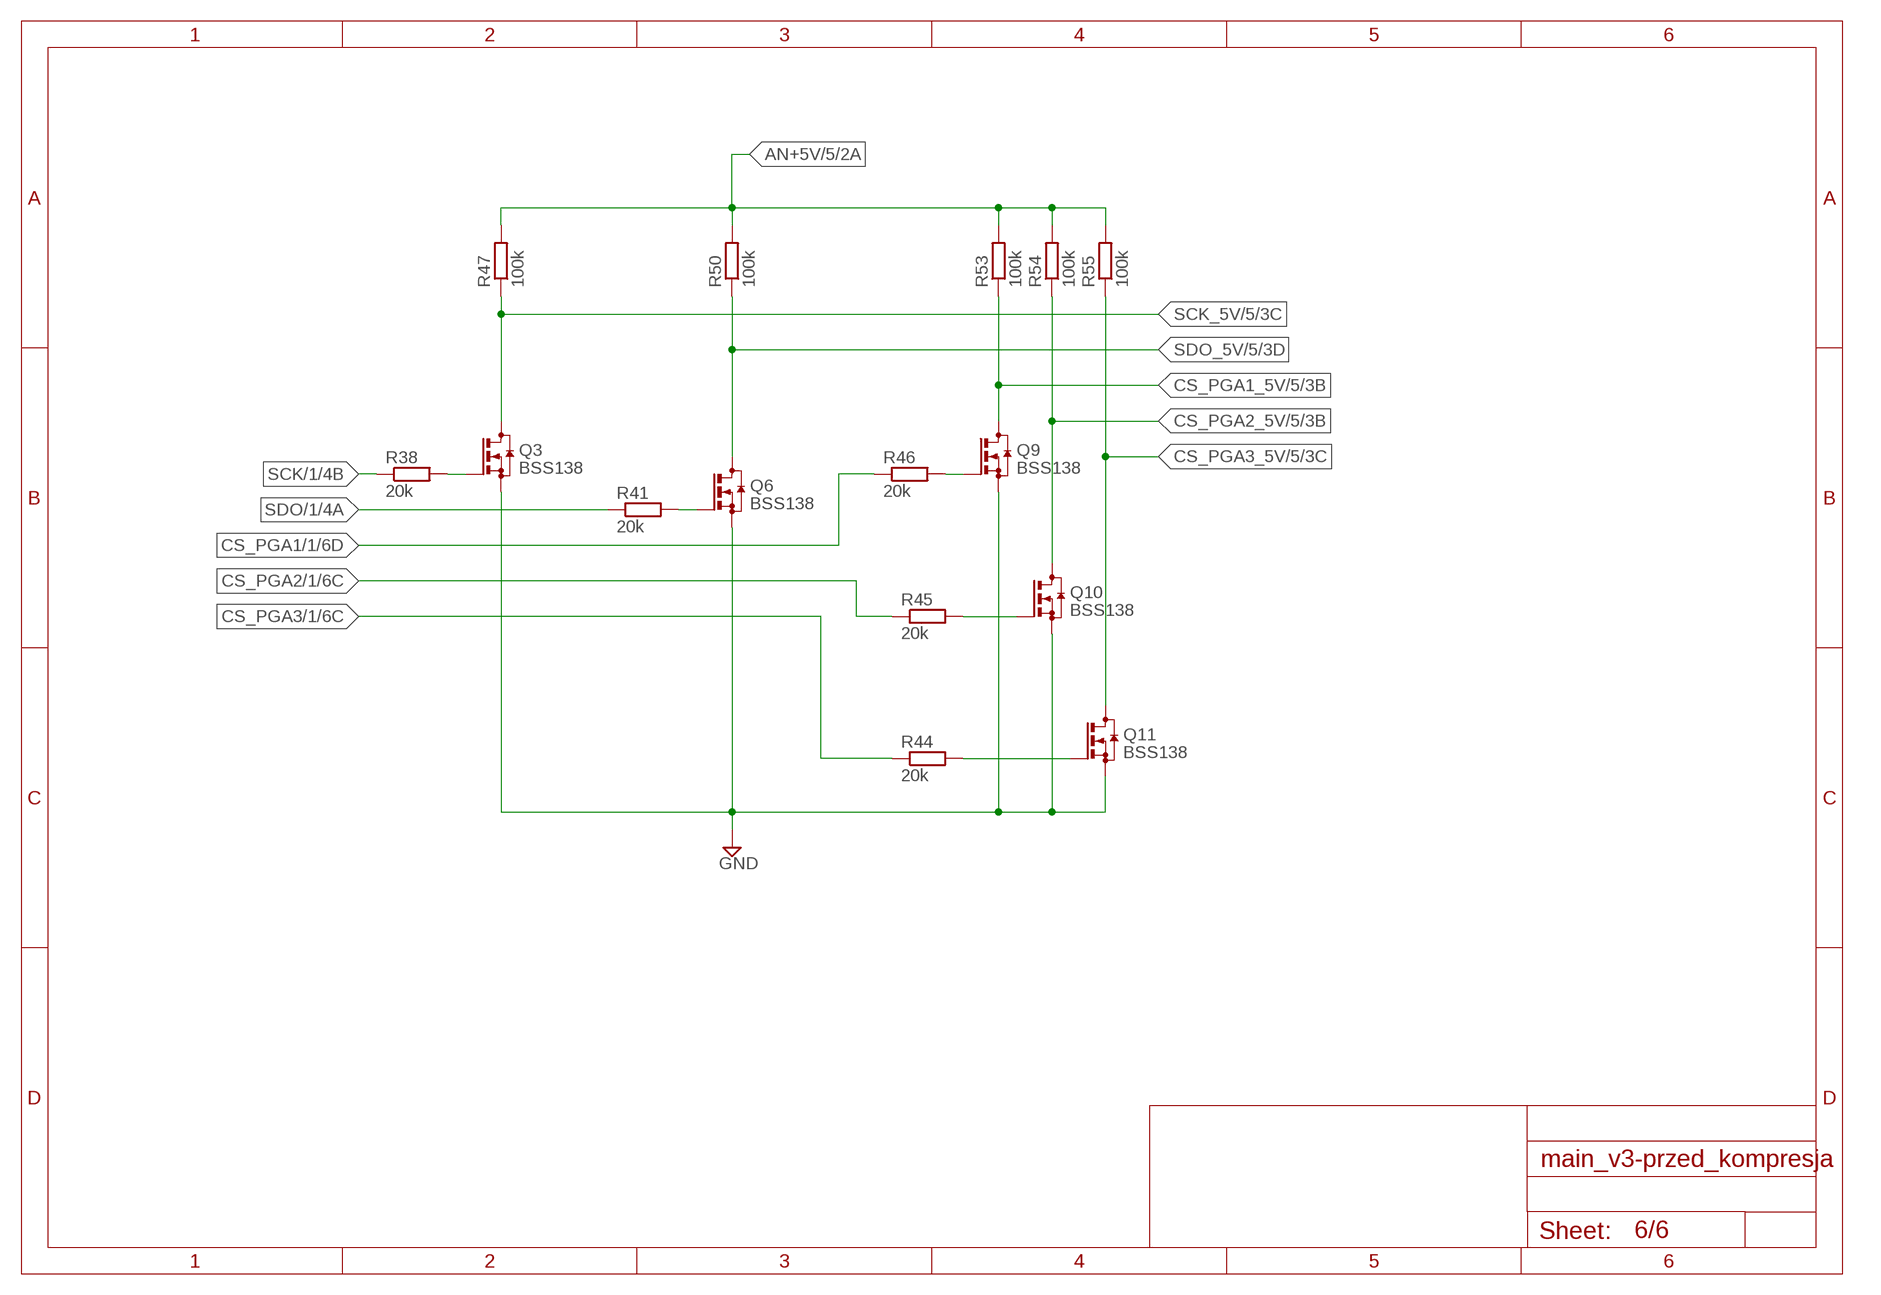
[diagram p5: schematic, sheet 6]

### Parts
Q3  BSS138  BSS123  [SOT23]
Q6  BSS138  BSS123  [SOT23]
Q9  BSS138  BSS123  [SOT23]
Q10  BSS138  BSS123  [SOT23]
Q11  BSS138  BSS123  [SOT23]
R38  20k  R-EU_M0805  [M0805]
R41  20k  R-EU_M0805  [M0805]
R44  20k  R-EU_M0805  [M0805]
R45  20k  R-EU_M0805  [M0805]
R46  20k  R-EU_M0805  [M0805]
R47  100k  R-EU_M0805  [M0805]
R50  100k  R-EU_M0805  [M0805]
R53  100k  R-EU_M0805  [M0805]
R54  100k  R-EU_M0805  [M0805]
R55  100k  R-EU_M0805  [M0805]

### Nets
AN+5V: R47.2 R50.2 R53.2 R54.2 R55.2 ; also sheet 5
CS_PGA1: R46.1 ; also sheet 1
CS_PGA1_5V: Q9.3(D) R53.1 ; also sheet 5
CS_PGA2: R45.1 ; also sheet 1
CS_PGA2_5V: Q10.3(D) R54.1 ; also sheet 5
CS_PGA3: R44.1 ; also sheet 1
CS_PGA3_5V: Q11.3(D) R55.1 ; also sheet 5
GND: Q3.2(S) Q6.2(S) Q9.2(S) Q10.2(S) Q11.2(S) ; also sheet 1,2,3
N$10: Q9.1(G) R46.2
N$21: Q11.1(G) R44.2
N$36: Q3.1(G) R38.2
N$51: Q6.1(G) R41.2
N$53: Q10.1(G) R45.2
SCK: R38.1 ; also sheet 1,2,5
SCK_5V: Q3.3(D) R47.1 ; also sheet 5
SDO: R41.1 ; also sheet 1,2,5
SDO_5V: Q6.3(D) R50.1 ; also sheet 5

## Library data of the parts
C1-C38 C41-C45 C47 C48 C50-C56 C59 C60 C62-C64 = rcl:C-EU: CAPACITOR, European symbol
C39 C40 C46 C49 C57 C58 C61 C65 = rcl:CPOL-EU: POLARIZED CAPACITOR, European symbol
CONN1 = mechanika:GNIAZDO4
D1 D3 D4 = diode:BAT54S: Schottky Diodes Source: Fairchild .. BAT54.pdf
D2 = diode:DIODE-: DIODE
FB1-FB3 FB5-FB9 = passives:FERRITE_BEAD
IC1 = lib1:ENC28J60
IC2 = lib1:HX1188NL
IC3 IC4 = lib1:ADXL001
IC5 = lib1:DSPIC33FJ128MC706: DSPIC33FJ128MC706 edit this description Auto generated by make-symbol-device-package-bsdl.ulp Rev. 34 Source: DSPIC33FJ128MC706.bsdl
IC6 IC13 = v-reg:78XXS: VOLTAGE REGULATOR
IC7 IC16 IC19 IC20 = linear:REF02: VOLTAGE REFERENCE
IC8 IC11 IC14 = moje:MCP4921
IC9 = lib1:ADR3433ARJZ
IC10 = lib1:TSR-1-2490
IC12 = lib1:MCP1*0T: POWER SUPPLY MONITOR replacement for Maxim MAX809 and MAX810
IC15 IC17 IC18 = lib1:MCP6S21
ICD = con-molex:87758-0616: 6 Pin - 2mm Dual Row Single Wafer, Vertical T/H HDR Source: http://www.molex.com/pdm_docs/sd/877580616_sd.pdf
J1 = con-amp:555153-1: AMP connector
L1 = lib1:ELL6RH8R2M
LED0 LED1-LED4 = led:LED: LED OSRAM: - CHIPLED LG R971, LG N971, LY N971, LG Q971, LY Q971, LO R971, LY R971 LH N974, LH R974 LS Q976, LO Q976, LY Q976 LO Q996 - Hyper CHIPLED LW Q18S LB Q993, LB Q99A, LB R99A - SideLED LS A670, LO A670, LY A670, LG A670, LP A670 LB A673, LV A673, LT A673, LW A673 LH A674 LY A675 LS A676, LA A676, LO A676, LY A676, LW A676 LS A679, LY A679, LG A679 - Hyper Micro SIDELED® LS Y876, LA Y876, LO Y876, LY Y876 LT Y87S - SmartLED LW L88C, LW L88S LB L89C, LB L89S, LG L890 LS L89K, LO L89K, LY L89K LS L896, LA L896, LO L896, LY L896 - TOPLED LS T670, LO T670, LY T670, LG T670, LP T670 LSG T670, LSP T670, LSY T670, LOP T670, LYG T670 LG T671, LOG T671, LSG T671 LB T673, LV T673, LT T673, LW T673 LH T674 LS T676, LA T676, LO T676, LY T676, LB T676, LH T676, LSB T676, LW T676 LB T67C, LV T67C, LT T67C, LS T67K, LO T67K, LY T67K, LW E67C LS E67B, LA E67B, LO E67B, LY E67B, LB E67C, LV E67C, LT E67C LW T67C LS T679, LY T679, LG T679 LS T770, LO T770, LY T770, LG T770, LP T770 LB T773, LV T773, LT T773, LW T773 LH T774 LS E675, LA E675, LY E675, LS T675 LS T776, LA T776, LO T776, LY T776, LB T776 LHGB T686 LT T68C, LB T68C - Hyper Mini TOPLED® LB M676 - Mini TOPLED Santana® LG M470 LS M47K, LO M47K, LY M47K Source: http://www.osram.convergy.de LUXEON: - LUMILED® LXK2-PW12-R00, LXK2-PW12-S00, LXK2-PW14-U00, LXK2-PW14-V00 LXK2-PM12-R00, LXK2-PM12-S00, LXK2-PM14-U00 LXK2-PE12-Q00, LXK2-PE12-R00, LXK2-PE12-S00, LXK2-PE14-T00, LXK2-PE14-U00 LXK2-PB12-K00, LXK2-PB12-L00, LXK2-PB12-M00, LXK2-PB14-N00, LXK2-PB14-P00, LXK2-PB14-Q00 LXK2-PR12-L00, LXK2-PR12-M00, LXK2-PR14-Q00, LXK2-PR14-R00 LXK2-PD12-Q00, LXK2-PD12-R00, LXK2-PD12-S00 LXK2-PH12-R00, LXK2-PH12-S00 LXK2-PL12-P00, LXK2-PL12-Q00, LXK2-PL12-R00 Source: www.luxeon.com KINGBRIGHT: KA-3528ASYC Source: www.kingbright.com
Q1 Q2 = crystal:CRYSTAL: CRYSTAL
Q3 Q6 Q9-Q11 = transistor-small-signal:BSS123: N-CHANNEL MOS FET
R1-R15 R21 R22 R24-R27 R29-R31 R35-R38 R41 R44-R47 R50 R53-R55 = rcl:R-EU_: RESISTOR, European symbol
SUPP = connectors:DG318-3.5-2P
TP1 TP2 = testpad:PTR1: TEST PIN
U$1 U$2 = lib-radiatory:D02PA

## Board
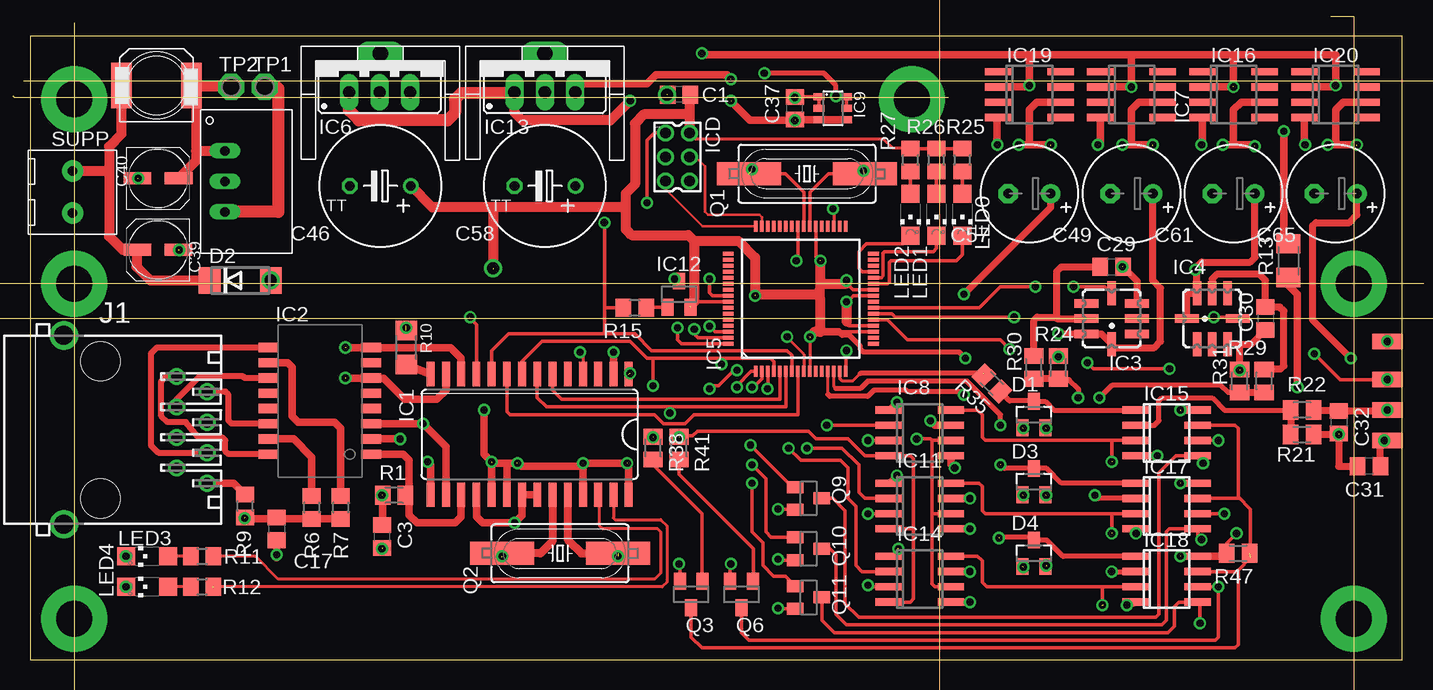
[diagram p6: board, top side]
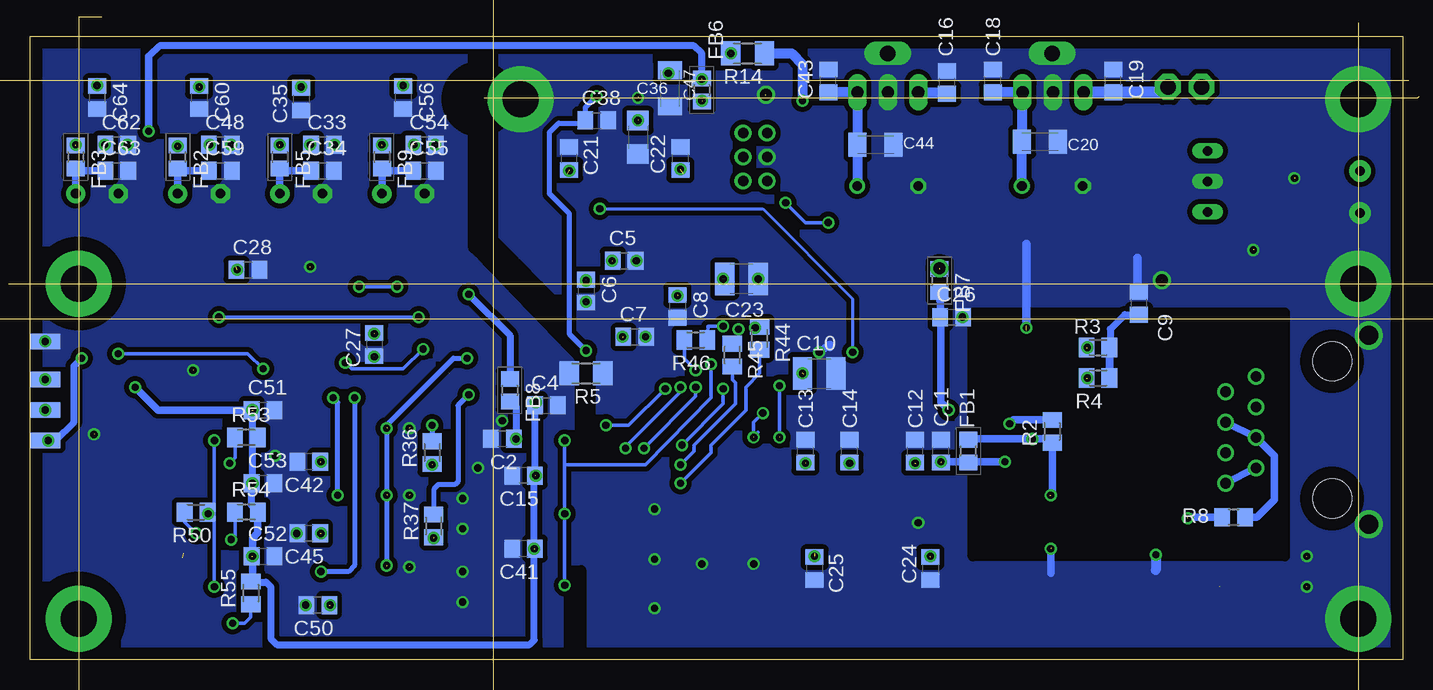
[diagram p7: board, bottom side, seen from below]

Size 114.41 x 51.99 mm. Coordinates in mm from the lower left corner, seen from the top.
Outline: 0,0 114.41,0 114.41,51.99 0,51.99 0,0
Copper layers (1*16): Top 0.035mm / dielectric 1.5mm / Bottom 0.035mm
Design rules "drukowane.pl *": minimum track width 8mil, minimum drill 16mil, track to track 8mil, track to pad 8mil, pad to pad 8mil, via to via 8mil, smd to smd 0mil, copper to edge 40mil, drill to drill 8mil, minimum pad ring 10mil, minimum via ring 8mil, stop-mask expansion 4mil, vias tented up to drill 0mil, thermal gap 10mil
bRestrict: area 9.8,8.6 to 35.8,29; area 74.2,44 to 79.7,49.5; area 75.8,34.3 to 77.5,51.3; area 74,32.1 to 77.1,35.2; area 72,30 to 75.1,33.1; area 69.9,28 to 73.1,31.1; area 67.7,18.3 to 68.6,25.5; area 68.5,-1.1 to 69.5,7.5; area 106.9,27.9 to 113.9,34.9; area 106.9,-0.1 to 113.9,6.9
Milling: 12 lines

### Footprints (pad centres in the part's own frame; a part is rotated, then mirrored left to right if it is on the bottom)
C0805 = smd 1.3 x 1.5: 1 -0.95,0; 2 0.95,0
C1210 = smd 1.6 x 2.7: 1 -1.4,0; 2 1.4,0
C1206K = smd 1.5 x 2: 1 -1.5,0; 2 1.5,0
C1206 = smd 1.6 x 1.8: 1 -1.4,0; 2 1.4,0
UD-5X5,8_NICHICON = smd 2.3 x 1: + 1.725,0; - -1.7,0
TT5D10 = drill 0.813 round: + -2.54,0 | drill 0.813 octagon: - 2.54,0
E3,5-8 = drill 0.813 pad 1.6 round: + -1.778,0 | drill 0.813 pad 1.6 octagon: - 1.778,0
GNIAZDO = smd 2.54 x 1.27 bottom: B1 0,4.445; B2 0,1.27; B3 0,-1.27; B4 0,-3.81 | smd 2.54 x 1.27: T1 0,4.445; T2 0,1.27; T3 0,-1.27; T4 0,-3.81
SOT23 = smd 1 x 1.4: 1 -0.95,-1.1; 2 0.95,-1.1; 3 0,1.1
DO214AA = smd 1.8 x 2.2: A 2.55,0; C -2.55,0
R0805 = smd 1.3 x 1.5: 1 -0.95,0; 2 0.95,0
SO28W = smd 0.66 x 2.032: 1 -8.255,-5.029; 2 -6.985,-5.029; 3 -5.715,-5.029; 4 -4.445,-5.029; 5 -3.175,-5.029; 6 -1.905,-5.029; 7 -0.635,-5.029; 8 0.635,-5.029; 9 1.905,-5.029; 10 3.175,-5.029; 11 4.445,-5.029; 12 5.715,-5.029; 13 6.985,-5.029; 14 8.255,-5.029; 15 8.255,5.029; 16 6.985,5.029; 17 5.715,5.029; 18 4.445,5.029; 19 3.175,5.029; 20 1.905,5.029; 21 0.635,5.029; 22 -0.635,5.029; 23 -1.905,5.029; 24 -3.175,5.029; 25 -4.445,5.029; 26 -5.715,5.029; 27 -6.985,5.029; 28 -8.255,5.029
TRAFO_H*NL = smd 0.76 x 1.67: 1 -4.445,-4.445; 2 -3.175,-4.445; 3 -1.905,-4.445; 4 -0.635,-4.445; 5 0.635,-4.445; 6 1.905,-4.445; 7 3.175,-4.445; 8 4.445,-4.445; 9 4.445,4.089; 10 3.175,4.089; 11 1.905,4.089; 12 0.635,4.089; 13 -0.635,4.089; 14 -1.905,4.089; 15 -3.175,4.089; 16 -4.445,4.089
LCC8_LONG = smd 2 x 0.7: 1 -2.121,1.27; 2 -2.121,0; 3 -2.121,-1.27; 5 2.121,-1.27; 6 2.121,0; 7 2.121,1.27 | smd 0.7 x 2: 4 0,-2.121; 8 0,2.121
TQFP64_10X10 = smd 0.9 x 0.3: 1 -6.05,3.75; 2 -6.05,3.25; 3 -6.05,2.75; 4 -6.05,2.25; 5 -6.05,1.75; 6 -6.05,1.25; 7 -6.05,0.75; 8 -6.05,0.25; 9 -6.05,-0.25; 10 -6.05,-0.75; 11 -6.05,-1.25; 12 -6.05,-1.75; 13 -6.05,-2.25; 14 -6.05,-2.75; 15 -6.05,-3.25; 16 -6.05,-3.75; 33 6.05,-3.75; 34 6.05,-3.25; 35 6.05,-2.75; 36 6.05,-2.25; 37 6.05,-1.75; 38 6.05,-1.25; 39 6.05,-0.75; 40 6.05,-0.25; 41 6.05,0.25; 42 6.05,0.75; 43 6.05,1.25; 44 6.05,1.75; 45 6.05,2.25; 46 6.05,2.75; 47 6.05,3.25; 48 6.05,3.75 | smd 0.3 x 0.9: 17 -3.75,-6.05; 18 -3.25,-6.05; 19 -2.75,-6.05; 20 -2.25,-6.05; 21 -1.75,-6.05; 22 -1.25,-6.05; 23 -0.75,-6.05; 24 -0.25,-6.05; 25 0.25,-6.05; 26 0.75,-6.05; 27 1.25,-6.05; 28 1.75,-6.05; 29 2.25,-6.05; 30 2.75,-6.05; 31 3.25,-6.05; 32 3.75,-6.05; 49 3.75,6.05; 50 3.25,6.05; 51 2.75,6.05; 52 2.25,6.05; 53 1.75,6.05; 54 1.25,6.05; 55 0.75,6.05; 56 0.25,6.05; 57 -0.25,6.05; 58 -0.75,6.05; 59 -1.25,6.05; 60 -1.75,6.05; 61 -2.25,6.05; 62 -2.75,6.05; 63 -3.25,6.05; 64 -3.75,6.05
78XXS = drill 1.016 long: GND 0,-2.54; IN -2.54,-2.54; OUT 2.54,-2.54
SO08 = smd 0.6 x 2.2: 1 -1.905,-2.6; 2 -0.635,-2.6; 3 0.635,-2.6; 4 1.905,-2.6; 5 1.905,2.6; 6 0.635,2.6; 7 -0.635,2.6; 8 -1.905,2.6
SO-08 = smd 0.6 x 2.2: 1 -0.635,-2.6; 2 0.635,-2.6; 3 1.905,-2.6; 4 3.175,-2.6; 5 3.175,2.6; 6 1.905,2.6; 7 0.635,2.6; 8 -0.635,2.6
SOT23-6 = smd 0.6 x 0.9: 1 -0.95,-1.15; 2 0,-1.15; 3 0.95,-1.15; 4 0.95,1.15; 5 0,1.15; 6 -0.95,1.15
TSR1 = drill 0.8 long: 1 2.54,0; 2 0,0; 3 -2.54,0
SOT23B-3 = smd 1 x 1.4: 1 -0.95,-1.1; 2 0.95,-1.1; 3 0,1.1
SOIC8 = smd 0.6 x 2.2: 1 -1.905,-2.6; 2 -0.635,-2.6; 3 0.635,-2.6; 4 1.905,-2.6; 5 1.905,2.6; 6 0.635,2.6; 7 -0.635,2.6; 8 -1.905,2.6
87758-0616 = drill 0.9 pad 1.27 round: 1 -2,-1; 2 -2,1; 3 0,-1; 4 0,1; 5 2,-1; 6 2,1
555153-1 = drill 0.889 round: 1 -4.445,6.35; 2 -3.175,8.89; 3 -1.905,6.35; 4 -0.635,8.89; 5 0.635,6.35; 6 1.905,8.89; 7 3.175,6.35; 8 4.445,8.89 | drill 1.575 pad 2.184 round: G1 -7.874,-3.048; G2 7.874,-3.048 | hole 3.251: -5.715,0; 5.715,0
L_PKG_60X60 = smd 1.7 x 3.8: 1 -2.921,0; 2 2.921,0
CHIPLED_1206 = smd 1.5 x 1.5: A 0,-1.75; C 0,1.75
HC49UP = smd 5.334 x 1.93: 1 -4.826,0; 2 4.826,0
M0805 = smd 1.3 x 1.6: 1 -0.95,0; 2 0.95,0
M1206 = smd 1.6 x 2: 1 -1.4,0; 2 1.4,0
R1206 = smd 1.6 x 1.803: 1 -1.422,0; 2 1.422,0
DG381X2-3.5 = drill 0.8 pad 1.778 round: 1 -1.75,0; 2 1.75,0
P1-13 = drill 1.321 pad 2.159 octagon: TP 0,0
D02PA = drill 1.3 long: P$1 0,0

### Placement (x,y rotation side)
C1  54.1,47.12 180 top
C2  75.06,18.41 180 bottom
C3  29.34,10.29 270 top
C4  71.37,21.21 0 bottom
C5  64.9,33.27 0 bottom
C6  68.07,30.73 270 bottom
C7  64.01,26.92 0 bottom
C8  60.45,29.46 270 bottom
C9  21.97,29.72 90 bottom
C10  48.64,23.88 0 bottom
C11  38.48,17.4 90 bottom
C12  40.64,17.4 90 bottom
C13  49.78,17.4 90 bottom
C14  46.1,17.4 90 bottom
C15  73.28,15.37 180 bottom
C16  37.97,48.13 90 bottom
C17  20.57,10.92 270 top
C18  34.16,48.26 90 bottom
C19  24.13,48.26 90 bottom
C20  30.23,43.18 0 bottom
C21  69.47,41.78 90 bottom
C22  60.2,41.78 90 bottom
C23  55.12,31.75 180 bottom
C24  39.37,7.62 270 bottom
C25  49.02,7.62 270 bottom
C26  37.59,28.58 0 bottom
C27  85.73,26.29 270 bottom
C28  96.27,32.51 0 bottom
C29  90.17,32.77 0 top
C30  103,28.45 270 top
C31  111.63,16.13 180 top
C32  109.09,19.81 270 top
C33  90.04,42.93 0 bottom
C34  90.04,40.77 0 bottom
C35  91.82,46.74 270 bottom
C36  63.75,43.56 270 bottom
C37  63.75,45.97 90 top
C38  67.18,44.96 0 bottom
C39  10.67,34.16 180 top
C40  10.67,40.13 0 top
C41  73.28,9.27 180 bottom
C42  91.19,16.51 180 bottom
C43  47.88,48.26 90 bottom
C44  43.94,42.93 0 bottom
C45  91.19,10.54 180 bottom
C46  29.21,39.5 180 top
C47  61.09,47.62 270 bottom
C48  98.55,42.93 0 bottom
C49  91.82,38.86 180 top
C50  90.42,4.57 180 bottom
C51  95,20.83 0 bottom
C52  95,8.64 0 bottom
C53  95,14.73 0 bottom
C54  81.53,42.93 0 bottom
C55  81.53,40.77 0 bottom
C56  83.31,46.86 270 bottom
C57  83.31,38.86 180 top
C58  42.93,39.5 180 top
C59  98.55,40.77 0 bottom
C60  100.33,46.86 270 bottom
C61  100.33,38.86 180 top
C62  107.19,42.93 0 bottom
C63  107.19,40.77 0 bottom
C64  108.84,46.86 270 bottom
C65  108.84,38.86 180 top
CONN1  113.16,22.1 0 top
D1  83.69,20.45 0 top
D2  17.53,31.62 0 top
D3  83.69,14.86 0 top
D4  83.69,8.89 0 top
FB1  36.2,17.4 90 bottom
FB2  102.11,41.91 270 bottom
FB3  110.62,41.91 270 bottom
FB5  93.6,41.91 270 bottom
FB6  58.42,47.5 270 bottom
FB7  38.61,31.62 270 bottom
FB8  74.42,22.48 270 bottom
FB9  85.09,41.91 270 bottom
IC1  41.66,18.8 180 top
IC2  24,21.59 90 top
IC3  90.17,28.45 180 top
IC4  98.55,28.45 90 top
IC5  64.26,30.1 90 top
IC6  29.14,49.86 0 top
IC7  91.82,47.12 270 top
IC8  74.17,20.19 270 top
IC9  66.93,45.97 270 top
IC10  16.26,39.88 90 top
IC11  74.17,14.1 270 top
IC12  54.1,30.48 0 top
IC13  42.92,49.86 0 top
IC14  74.17,8 270 top
IC15  94.74,18.92 270 top
IC16  100.33,47.12 270 top
IC17  94.74,12.83 270 top
IC18  94.74,6.73 270 top
IC19  83.31,47.12 270 top
IC20  108.84,47.12 270 top
ICD  53.98,41.91 270 top
J1  5.87,19.18 270 top
L1  10.54,47.88 0 top
LED0  77.72,37.08 180 top
LED1  75.56,37.08 180 top
LED2  73.41,37.08 180 top
LED3  9.78,8.64 90 top
LED4  9.78,6.1 90 top
Q1  64.77,40.51 180 top
Q2  44.2,8.89 0 top
Q3  55.12,5.46 180 top
Q6  59.31,5.46 180 top
Q9  64.9,13.46 270 top
Q10  64.9,9.27 270 top
Q11  64.9,5.21 270 top
R1  30.35,13.72 0 top
R2  29.21,19.05 90 bottom
R3  25.4,26.03 180 bottom
R4  25.4,23.49 180 bottom
R5  68.07,23.88 180 bottom
R6  23.5,12.7 90 top
R7  25.91,12.7 90 top
R8  14.1,11.91 0 bottom
R9  17.94,12.83 90 top
R10  31.37,26.03 270 top
R11  14.35,8.64 0 top
R12  14.35,6.1 0 top
R13  104.9,33.27 90 top
R14  54.61,50.55 180 bottom
R15  50.42,29.34 180 top
R21  106.05,18.8 180 top
R22  106.05,20.83 0 top
R24  85.73,24.38 270 top
R25  77.72,41.66 90 top
R26  75.56,41.66 90 top
R27  73.41,41.66 90 top
R29  100.84,23.24 270 top
R30  83.69,24.38 270 top
R31  102.87,23.24 270 top
R35  80.19,23.04 135 top
R36  80.9,17.27 90 bottom
R37  80.77,11.18 90 bottom
R38  51.94,17.65 270 top
R41  54.1,17.65 270 top
R44  53.59,26.8 270 bottom
R45  55.88,25.4 270 bottom
R46  58.93,26.67 180 bottom
R47  100.71,8.89 180 top
R50  100.58,12.32 180 bottom
R53  96.39,18.54 0 bottom
R54  96.39,12.32 0 bottom
R55  96.01,5.59 90 bottom
SUPP  3.56,38.99 90 top
TP1  19.56,47.75 0 top
TP2  16.76,47.75 0 top
U$1  42.93,50.55 0 top
U$2  29.21,50.55 0 top

### Tracks (layer width: path | path; a pad name or v marks a point on that pad's centre or on a via)
3V3REF  (via drill 0.6)
  Top 0.305: 68.01,25.72 IC5.16 | IC9.5 IC9.6 v67.18,46.99
  Top 0.406: v68.07,25.78 68.01,25.72 | v61.21,48.9 66.17,48.9 67.18,47.88 v67.18,46.99
  Bottom 0.305: C47.1 61.19,48.77 v61.21,48.9
  Bottom 0.406: v67.18,46.99 68.13,46.04 C38.1 68.36,44.73 70.36,44.73 71.12,43.97 71.12,38.86 69.47,37.21 69.47,27.18 v68.07,25.78
!MCLR  (via drill 0.6)
  Top 0.203: IC5.7 63.5,24.04
  Top 0.305: IC5.7 63.51,25.39 63.12,25.78 51.82,25.78 50.42,27.18 47.88,27.18 | IC1.10 38.48,25.78 39.88,27.18 47.88,27.18 | 52.88,43.82 ICD.1 52.94,43.94 52.07,43.94 51.44,43.31 v51.44,38.1 | v47.88,36.45 47.88,29.34 | 47.88,29.34 47.88,27.18 | 47.88,29.34 R15.2
  Bottom 0.305: v51.44,38.1 49.78,36.45 48.01,36.45 v47.88,36.45
+3V3  (via drill 0.6, 0.6 pad 0.25, 1)  (13 unrouted)
  Top 0.254: IC5.10 65.01,26.87 C7.1 | R27.2 73.34,42.67 71.88,42.67 71.12,43.43 55.45,43.43 ICD.2
  Top 0.279: IC5.26 68.59,30.85 68.07,31.37 | 65.89,27.35 IC5.19 | 55.12,29.85 IC5.57
  Top 0.305: 68.07,31.37 v68.07,31.62 C6.1 | IC5.38 65.51,33.61 C5.1 65.91,33.21 | 55.07,29.47 55.37,29.84 55.12,29.85 | 65.91,31.24 65.91,31.37 | R27.2 R26.2 R25.2
  Top 0.406: v77.98,25.15 77.47,25.65 69.47,25.65 69.22,25.91 69.22,26.16 68.33,27.05 67.69,27.05 67.39,27.35
  Top 0.61: 55.37,29.84 55.12,29.76 | 65.85,30.67 65.59,30.41 | 67.39,27.35 65.89,27.35
  Top 0.813: 55.37,34.92 54.89,35.41 50.17,35.41 49.83,35.75 49.78,35.75 49.66,35.88 49.66,37.72 | 55.37,34.92 55.37,29.84 | 65.59,30.41 C8.1 | 65.91,31.24 65.85,30.67 65.89,29.74 65.89,27.35 65.38,27.35 C7.1 | 65.91,33.21 65.91,31.37 68.07,31.37 | v60.45,30.35 60.45,33.53 59.06,34.92 55.37,34.92 | C1.1 54.98,46.79 54.98,45.34 | 54.98,45.34 ICD.2 | 54.98,45.34 54.85,45.47 51.18,45.47 50.42,44.7 50.42,39.62 49.66,38.86 49.66,37.72 | 38.61,37.72 v38.61,32.64 | 49.66,37.72 38.61,37.72 | C46.+ 33.53,37.72 38.61,37.72
  Bottom 0.305: 84.71,19.56 v84.71,19.3 | 84.71,7.79 D4.2
  Bottom 0.406: v77.98,25.15 79.12,25.15 84.71,19.56 | v84.71,19.3 v84.71,13.72 84.71,7.79
  Bottom 0.813: C18.1 IC6.OUT 31.68,43.23 C20.1 31.73,39.39 C46.+
  other vias: 65.02,26.92 65.91,33.27 84.71,7.87
+3V3_ENC  (via drill 0.6)  (7 unrouted)
  Top 0.61: v46.1,16.38 C14.1 | v46.1,16.38 46.1,16.13 | 46.1,16.13 IC1.25 | IC1.28 49.91,16.32 C13.1 | IC1.19 C11.1 38.55,16.38 39.75,16.38 | 39.75,16.38 IC1.20 | 39.75,16.38 40.57,16.38 C12.1 40.96,16.13 46.1,16.13 | IC1.15 33.4,16.26 v33.15,16.51 | v37.85,20.83 37.85,17.14 v38.48,16.51 | v49.78,16.38 v46.1,16.38
  Bottom 0.61: v38.48,16.51 36.26,16.51 | 36.26,16.51 FB1.1 | 36.26,16.51 v33.15,16.51 | v37.85,20.83 38.48,21.46 38.48,28.51 C26.1 38.54,29.59 FB7.2
  other vias: 40.64,16.38
+5V  (via drill 0.6)  (2 unrouted)
  Top 0.61: IC13.OUT 46.15,48.01 51.44,48.01 52.2,48.77 58.1,48.77 FB6.1 | v104.52,44.07 104.52,35.05 R13.2
  Bottom 0.6: v58.42,48.39 58.42,50.55 59.06,51.18 103.63,51.18 104.52,50.29
  Bottom 0.61: 104.52,50.29 v104.52,44.07
  Bottom 0.813: C43.1 IC13.OUT 45.46,42.94 C44.1 45.44,39.52 C58.+
ACC_X  (via drill 0.6)
  Top 0.4: v90.17,7.37 IC18.2 | v87.38,21.84 87.38,22.61 86.61,23.37 85.79,23.37 R24.2
  Top 0.6: R24.2 R30.2
  Bottom 0.4: v90.17,7.37 87.88,7.37 87.38,7.87 v87.38,21.84
ACC_Y  (via drill 0.6)
  Top 0.4: IC17.2 89.03,13.46 v88.77,13.72 | v89.15,21.84 90.24,22.93 99.25,22.93 99.88,22.29 R29.2
  Top 0.6: R29.2 R31.2
  Bottom 0.4: v88.77,13.72 88.77,21.46 v89.15,21.84
ACC_Z
  Top 0.4: IC15.2 93.73,19.56 94.11,19.94 94.11,21.59 94.36,21.84 98.55,21.84 99.57,20.83 R22.1
  Top 0.6: R22.1 R21.2
AGND  (via drill 0.6)  (11 unrouted)
  Top 0.59: IC8.7 75.69,19.56 | 75.44,19.56 v75.06,19.94
  Top 0.6: R21.1 v109.09,18.8 109.09,16.13 C31.2 | C30.2 101.83,26.33 IC4.3 100.17,26.33 100.84,26.29 R29.1 | IC3.3 92.29,31.59 C29.2
  Top 0.61: IC15.4 v93.98,17.02 | IC17.4 v92.2,10.54 | IC18.4 v91.44,4.57 | IC14.7 v78.36,7.37 | IC14.5 v78.36,4.83 | 75.69,19.56 75.44,19.56 | IC8.5 76.77,16.32 v77.09,16 | IC11.7 v78.36,13.46 | IC11.5 v78.36,10.92 | IC7.4 89.22,43.05 C33.2 | IC16.4 97.73,43.05 C48.2 | IC20.4 C62.2 | IC19.4 80.58,45.21 C54.2
  other vias: 113.16,26.54 80.65,42.93 89.03,42.93 97.66,42.93 106.3,42.93 91.06,32.77 85.73,25.27 100.84,24.13 82.8,7.75 82.8,13.72 82.8,19.3
  pour Bottom (isolate 0.406, no thermals): 68.83,-0.13 115.06,-0.13 114.43,36.58 114.43,52.07 77.47,52.07 77.47,33.27 68.83,24.26
AN+5V  (via drill 0.6)  (9 unrouted)
  Top 0.305: IC18.8 C52.1 | 71.63,20.83 IC8.1 | IC11.1 71.63,14.73 | 99.51,8.64 R47.2 99.76,9.72 v100.58,10.54
  Top 0.6: C51.1 IC15.8 | C53.1 IC17.8 | v72.26,21.46 71.63,20.83 | 71.63,14.73 v72.26,15.37 | IC14.1 72.39,8.64 v72.39,9.27
  Top 0.61: R13.1 104.9,31.24 105.66,30.48 v105.66,22.73 | IC18.8 99.7,8.64 99.76,8.7 R47.2
  Bottom 0.305: 95.95,14.67 v95.89,14.73 | 95.89,18.54 R53.2 | 95.95,6.6 R55.2 95.95,6.48 | v100.58,10.54 101.53,11.49 R50.2 | R54.2 95.95,12.82
  Bottom 0.6: v95.89,14.73 95.89,18.54 95.89,20.77 | 95.95,12.82 95.95,14.67 | 95.95,6.48 94.74,6.48 94.36,6.1 94.36,1.78 93.85,1.27 72.77,1.27 72.39,1.65 v72.39,9.27 72.39,15.37 C15.1 C4.1 72.32,21.46 v72.26,21.46
  Bottom 0.61: v105.66,22.73 103.76,20.83 C51.1 | 95.95,6.6 95.89,6.67 v95.89,8.64 95.89,10.16 95.44,10.6 R54.2
  other vias: 95.89,20.83
AN+9V  (via drill 0.6)  (7 unrouted)
  Top 0.61: IC19.2 83.25,47.75 C56.1 | IC7.2 91.76,47.75 C35.1 v91.82,47.75 | IC16.2 100.27,47.75 C60.1 100.33,50.42 | IC20.2 108.78,47.75 C64.1 v108.84,47.88 108.84,50.42 100.33,50.42 | C56.1 v83.31,47.88 | 91.82,50.42 v91.82,47.75 | v91.82,47.75 91.82,49.91 | 91.82,50.42 100.33,50.42 | 83.31,50.42 56.14,50.42 R14.2 | 91.82,50.42 83.44,50.42 83.31,50.42 | 83.31,50.42 C56.1
  other vias: 100.33,47.75 56.01,50.55
CS_ETH
  Top 0.3: IC5.8 64.01,20.45
  Top 0.305: IC1.9 39.75,20.7 40.01,20.45 52.07,20.45 52.83,19.69 54.61,19.69 55.37,20.45 64.01,20.45 | IC5.8
CS_PGA1  (via drill 0.6)
  Top 0.29: v56.64,27.81 57.11,27.35 IC5.62
  Bottom 0.29: v56.64,27.81 57.91,27.81 R46.1
CS_PGA1_5V  (via drill 0.6)
  Top 0.305: v97.79,16.38 97.34,16.83 IC15.5 95.5,17.02 94.11,15.62 94.11,3.81 93.85,3.56 70.61,3.56 69.09,3.56 67.94,4.7 67.94,12.45 66.93,13.46 Q9.3
  Bottom 0.305: R53.1 97.34,16.83 v97.79,16.38
CS_PGA2  (via drill 0.6)
  Top 0.29: IC5.63 55.7,26.85 55.37,27.18
  Top 0.305: 55.37,27.18 v55.37,27.56
  Bottom 0.305: R45.1 55.37,26.35 v55.37,27.56
CS_PGA2_5V  (via drill 0.6)
  Top 0.305: v97.66,10.03 97.34,10.35 IC17.5 95,10.92 94.74,10.67 94.74,3.3 94.36,2.92 70.61,2.92 68.07,2.92 67.18,3.81 67.18,8.76 66.68,9.27 Q10.3
  Bottom 0.305: R54.1 97.34,10.35 v97.66,10.03
CS_PGA3  (via drill 0.6)
  Top 0.29: IC5.64 54.3,26.35
  Top 0.305: 54.3,26.35 53.98,26.67 v53.98,27.69
  Bottom 0.305: v53.98,27.69 53.91,27.75 R44.1
CS_PGA3_5V  (via drill 0.6)
  Top 0.3: 66.04,5.16 Q11.3
  Top 0.305: v97.54,3.05 97.54,4.63 IC18.5 95.76,4.83 95.38,4.45 95.38,2.79 94.87,2.29 70.61,2.29 67.06,2.29 66.04,3.3 66.04,5.16
  Bottom 0.305: R55.1 96.01,3.56 96.52,3.05 v97.54,3.05
CS_REF1  (via drill 0.6)
  Top 0.3: 61.51,22.65 IC5.3 | IC8.2 v66.42,19.56
  Top 0.305: v61.47,22.61 61.51,22.65
  Bottom 0.305: v66.42,19.56 64.52,19.56 v61.47,22.61
CS_REF2  (via drill 0.6)
  Top 0.3: IC5.2 61.01,23.42 60.33,22.73
  Top 0.305: 60.33,22.73 v60.2,22.73 | IC11.2 69.6,13.46 69.09,13.97 69.09,16.26 67.69,17.65 v64.77,17.65
  Bottom 0.305: v60.2,22.73 60.2,22.35 64.77,17.78 v64.77,17.65
CS_REF3  (via drill 0.6)
  Top 0.279: IC5.1 60.12,24.05
  Top 0.3: 67.56,16.64 68.2,16
  Top 0.305: 60.12,24.05 58.93,22.86 v58.93,22.73 | IC14.2 69.34,7.37 68.83,7.87 68.83,12.83 68.2,13.46 68.2,16 | 67.56,16.64 64.26,16.64 v63.25,17.65
  Bottom 0.305: v58.93,22.73 58.93,21.97 v63.25,17.65
GND  (via drill 0.6, 0.6 pad 0.25, 1, 3 pad 5.5)  (14 unrouted)
  Top 0.254: IC5.9 64.51,25.47 C7.2
  Top 0.279: IC5.20 68.29,27.85 68.07,28.19 | C6.2 68.64,30.35 IC5.25
  Top 0.3: v62.36,12.57 63.74,12.57 Q9.2 | v62.36,8.38 62.42,8.32 Q10.2 | v62.36,4.32 62.42,4.26 Q11.2 | v58.42,8 58.36,7.94 Q6.2 | v54.1,8 54.17,7.93 Q3.2
  Top 0.305: IC9.2 IC9.1 C37.2 | C5.2 64.01,33.34 IC5.41 | IC1.11 37.21,27.94 36.7,28.45 C26.2
  Top 0.61: v53.72,31.75 arc-90 53.98,31.5 IC12.3 | v48.64,25.65 IC1.2 | IC1.18 37.21,11.94 37.72,11.43 v40.39,11.43 41.02,12.06 IC1.21 IC1.22 | 20.57,8.51 v20.57,8.76 C17.2
  Top 0.813: C6.2 68.07,28.19
  Bottom 0.61: 47.75,26.03 47.75,26.29 v48.64,25.65 | v36.7,28.58 36.58,28.7 | v29.34,9.27 29.34,7.24
  Bottom 0.711: 31.37,34.67 31.37,27.84 | C9.2 arc90 22.1,30.8 22.1,33.53
  Bottom 0.813: v20.57,8.76 20.57,7.49
  other vias: 63.75,46.86 53.09,47.12 63.88,33.27 68.07,29.84 73.53,46.74 63.12,26.92 31.37,27.69 20.07,31.62 9.02,40.13 3.68,46.74 12.45,34.16 3.68,31.37 8,6.1 8,8.64 3.68,3.43
  pour Bottom (isolate 0.406, rank 2, no thermals): -1.91,51.44 -1.91,-1.65 132.97,-7.11 132.46,51.82
ICDC
  Top 0.229: IC5.48 56.05,36.15 52.96,39.24 52.96,39.89 ICD.5
ICDD
  Top 0.229: IC5.47 61.01,36.91 60.83,37.08 56.52,37.08 56.26,37.34 56.26,41.15 55.5,41.91 ICD.4
INT0  (via drill 0.6)
  Top 0.254: IC1.4 46.1,25.4 v45.85,25.65 | IC5.35 67.01,37.51 v66.93,37.59
  Bottom 0.254: v66.93,37.59 53.34,37.59 45.85,30.1 v45.85,25.65
LED0
  Top 0.279: IC5.27 71.48,31.35 71.63,31.5 71.63,33.15 71.75,33.27 77.22,33.27 77.72,33.78 LED0.C
LED1
  Top 0.279: IC5.28 70.97,31.85 71.12,32 71.12,33.91 71.25,34.04 75.31,34.04 75.56,34.29 LED1.C
LED2
  Top 0.279: IC5.29 69.38,32.35 69.09,32.64 69.09,34.04 69.72,34.67 72.77,34.67 72.77,34.7 LED2.C
N$1  (via drill 0.6)  (2 unrouted)
  Top 0.305: 90.17,18.29 IC15.3 | 90.17,18.29 90.17,16.58 C42.1 | IC8.8 78.99,20.83 79.38,20.45 79.38,18.54 79.63,18.29 90.17,18.29
  other vias: 90.17,16.51
N$2  (via drill 0.6)  (2 unrouted)
  Top 0.305: IC17.3 90.17,12.19 90.17,12.06 | 90.17,12.06 90.17,10.61 C45.1 | IC11.8 79.12,14.73 79.38,14.48 79.38,12.45 79.63,12.19 90.04,12.19 90.17,12.06
  other vias: 90.17,10.54
N$3  (via drill 0.6)  (4 unrouted)
  Top 0.61: IC16.6 100.97,46.48 100.33,45.85 100.33,42.93 | 100.33,42.93 C48.1 | 100.33,42.93 102.04,42.93 FB2.1
  other vias: 99.44,42.93 102.11,42.8
N$4  (via drill 0.6)  (3 unrouted)
  Top 0.61: IC20.6 109.47,46.48 108.84,45.85 108.84,42.93 | 108.84,42.93 v108.2,42.93 C62.1 | 108.84,42.93 110.55,42.93 FB3.1
  other vias: 110.62,42.93
N$5
  Top 0.61: IC2.15 21.97,18.41 23.5,16.89 R6.2
N$6  (via drill 0.6)  (2 unrouted)
  Top 0.61: v30.86,18.41 IC2.2 | R1.1 29.4,11.3 C3.1
  Bottom 0.61: FB1.2 36.13,18.41 v30.86,18.41 29.53,18.41 R2.1 29.21,13.91 R1.1
  other vias: 29.34,13.72
N$7
  Top 0.61: IC2.10 21.46,24.77 21.84,24.38 21.84,20.32 22.35,19.81 25.4,19.81 25.91,19.3 R7.2
N$8
  Bottom 0.6: C9.1 23.17,28.77 24.38,27.56 24.38,26.1 R3.1
  Bottom 0.686: R3.1 R4.1
N$9  (via drill 0.6)  (2 unrouted)
  Top 0.61: R7.1 R6.1 20.58,11.75 | 20.58,11.75 C17.1 | 20.58,11.75 18.07,11.75 R9.1
  Bottom 0.61: R8.1 17.91,11.91 R9.1
  other vias: 17.91,11.81
N$10  (via drill 0.6)
  Top 0.3: 63.57,14.41 Q9.1
  Top 0.305: v58.93,24.13 58.67,24.13 57.4,22.86 56.64,22.86 v56.64,22.61 | v60.07,17.91 63.57,14.41
  Bottom 0.3: 56.64,21.34 v60.07,17.91
  Bottom 0.305: R46.2 59.88,25.08 v58.93,24.13 | v56.64,22.61 56.64,21.34
N$11  (via drill 0.6)  (1 unrouted)
  Top 0.305: IC14.6 75.44,6.1 75.18,6.35 75.18,12.19 | 75.18,12.19 IC11.6 | 75.18,18.29 75.18,12.19 | 75.18,18.29 IC8.6 | 75.18,18.29 75.06,18.41 C2.1 v73.91,18.41
  Bottom 0.305: FB8.2 73.91,21.15
  Bottom 0.6: 73.91,21.15 v73.91,18.41
N$12  (via drill 0.6)  (5 unrouted)
  Top 0.61: C37.1 IC9.3 IC9.4 | FB6.2 60.01,44.96 C36.1
  other vias: 63.75,44.96 58.42,46.61
N$13  (via drill 0.6)  (4 unrouted)
  Top 0.61: IC19.6 83.95,46.48 83.31,45.85 83.31,42.93 | 83.31,42.93 C54.1 | 83.31,42.93 85.02,42.93 FB9.1
  other vias: 82.42,42.93 85.09,42.93
N$14
  Bottom 0.61: J1.4 J1.5 10.7,17.02 10.7,13.34 12.1,11.94 12.19,11.91 R8.2
N$15
  Top 0.61: J1.8 16.98,14.73 R9.2
  Bottom 0.61: J1.8 J1.7
N$16  (via drill 0.6)  (2 unrouted)
  Top 0.305: v49.02,8.64 C25.1
  Top 0.686: IC1.24 44.83,10.03 45.97,8.89 Q2.2 48.13,8.89 48.01,8.76
N$17  (via drill 0.6)  (2 unrouted)
  Top 0.305: Q2.1 C24.1
  Top 0.686: IC1.23 43.56,9.91 42.55,8.89 Q2.1
  other vias: 39.37,8.64
N$18
  Top 0.686: IC1.14 R10.2
N$19  (via drill 0.6)  (2 unrouted)
  other vias: 50.04,23.88
N$20  (via drill 0.6)  (2 unrouted)
  Top 0.305: IC18.3 89.41,6.1 | 89.35,4.57 89.41,4.51 89.41,6.1 | IC14.8 78.99,8.64 79.38,8.25 79.38,6.48 79.76,6.1 89.41,6.1
  other vias: 89.41,4.57
N$21  (via drill 0.6)
  Top 0.305: v60.2,14.73 60.2,10.67 61.09,9.78 61.09,7.87 61.98,6.98 62.97,6.98 Q11.1
  Bottom 0.305: R44.2 53.59,23.88 54.74,22.73 54.74,20.83 57.66,17.91 57.66,17.27 v60.2,14.73
N$22
  Top 0.254: R11.1 LED3.A
N$23
  Top 0.254: R12.1 LED4.A
N$24
  Top 0.254: R11.2 18.8,8.64 20.7,6.73 52.07,6.73 52.58,7.24 52.58,10.67 52.32,10.92 47.75,10.92 47.5,11.18 47.5,13.64 IC1.26
N$25  (1 unrouted)
  Top 0.254: 15.24,6.1 52.71,6.1 53.09,6.48 53.09,11.18 52.58,11.68 48.77,11.68 48.64,11.81 IC1.27
N$26
  Top 0.29: 85.6,28.58 85.6,28.45
  Top 0.6: 85.6,28.45 IC3.6 | C29.1 85.98,32.77 85.6,32.38 85.6,28.58 83.95,28.58 83.69,28.32 R30.1
N$27
  Top 0.29: R31.1 103.06,24.26
  Top 0.6: IC4.6 98.55,31.75 98.93,32.13 102.49,32.13 103,31.62 C30.1 104.21,29.4 104.52,29.08 104.52,24.51 104.27,24.26 103.06,24.26
N$28  (via drill 3 pad 5.5)
  other vias: 110.36,31.37
N$29  (via drill 0.6)
  Top 0.29: 109.03,20.83 C32.1 | 113.09,20.76 CONN1.T3
  Top 0.6: R22.2 109.03,20.83 | C32.1 113.09,20.76
  other vias: 113.16,20.83
N$30  (via drill 0.6)
  Top 0.813: 20.57,47.75 20.7,47.62 | 40.31,47.24 IC13.IN 40.38,45.6 41.02,44.96 48.39,44.96 v50.04,46.61
  Top 1.016: IC10.3 20.7,37.34 20.7,47.62 | TP1.TP 20.57,47.75 | IC6.IN 26.6,45.79 27.43,44.96 34.8,44.96 35.43,45.59 35.43,46.74 35.94,47.24 40.31,47.24
  Bottom 0.813: C19.1 | IC13.IN 38.11,47.32 C16.1 | IC6.IN | v50.04,46.61 50.04,49.66 50.93,50.55 R14.1
  Bottom 1.016: TP1.TP 20,47.31 C19.1 IC6.IN
N$34  (via drill 0.6)  (3 unrouted)
  Top 0.61: IC7.6 92.46,46.48 91.82,45.85 91.82,42.93 | 91.82,42.93 v91.06,42.93 C33.1 | 91.82,42.93 93.53,42.93 FB5.1
  other vias: 93.6,42.93
N$35
  Top 0.813: C40.+ 13.84,41.58 13.84,42.42 | 13.84,47.75 13.84,42.42 | 13.84,47.75 13.72,47.88 L1.2 | 13.84,42.42 IC10.1 | TP2.TP 13.84,47.75
N$36
  Top 0.3: 56.01,6.62 Q3.1
  Top 0.305: R38.2 51.94,16.26 56.01,12.19 56.01,6.62
N$41
  Top 0.61: C39.+ 8.89,34.11
  Top 0.813: L1.1 7.62,43.82 6.6,42.77 6.6,40.64 | 6.6,40.64 6.6,35.31 7.75,34.16 C39.+ | D2.C 10.03,31.62 8.89,32.77 8.89,34.11 | SUPP.2 6.51,40.74 6.6,40.64
N$46  (via drill 0.6)  (2 unrouted)
  Top 0.279: IC5.56 56.9,30.35 56.64,30.61 v56.64,31.75 C23.2
N$47
  Top 0.305: IC12.1 51.41,29.38 R15.1
N$48  (via drill 0.6)  (2 unrouted)
  Top 0.29: IC5.40 64.51,38.99 62.99,40.51
  Top 0.305: 62.99,40.51 Q1.2
  other vias: 60.2,40.89
N$49  (via drill 0.6)  (2 unrouted)
  Top 0.29: IC5.39 65.01,38.98 66.55,40.51
  Top 0.305: 66.55,40.51 Q1.1 70.29,41.08
  other vias: 69.47,40.77
N$51
  Top 0.3: 60.33,9.27 60.33,6.63 Q6.1
  Top 0.305: R41.2 54.1,15.49 60.33,9.27
N$53  (via drill 0.6)
  Top 0.305: Q10.1 61.79,10.22 61.34,10.67 61.34,15.11 v60.2,16.26
  Bottom 0.305: v60.2,16.26 59.06,17.4 59.06,17.91 55.63,21.34 55.63,23.11 55.88,23.37 R45.2
N$60
  Top 0.305: LED0.A R25.1
N$61
  Top 0.305: LED1.A R26.1
N$62
  Top 0.305: LED2.A R27.1
S$3  (via drill 3 pad 5.5)
  other vias: 110.36,3.43
SCK  (via drill 0.6)  (2 unrouted)
  Top 0.305: IC1.8 41.02,24.89 42.67,26.54 50.04,26.54 51.44,25.15 51.94,25.15 | IC5.4 62.01,24.86 61.72,25.15 57.66,25.15 | 57.66,25.15 51.94,25.15 | 51.94,25.15 v51.94,22.86 | IC14.3 69.98,6.1 v69.85,6.22 | IC11.3 71.5,12.19 | IC11.3 71.63,12.19 | v69.85,12.19 IC11.3 | IC8.3 v69.85,18.29 | v57.66,24.64 57.66,25.15
  Bottom 0.3: 57.66,21.84 63.12,16.26 69.85,16.26
  Bottom 0.305: v51.94,22.86 R38.1 | v69.85,6.22 v69.85,12.19 69.85,16.26 v69.85,18.29 | 57.66,21.84 v57.66,24.64
  other vias: 51.94,18.54
SCK_5V  (1 unrouted)
  Top 0.305: IC15.7 100.46,19.56 100.71,19.3 100.71,13.59 | 100.71,13.59 100.71,13.46 IC17.7 | 100.71,7.49 100.58,7.37 IC18.7 | 100.71,7.49 100.71,1.27 100.46,1.02 70.61,1.02 56.01,1.02 55.12,1.91 Q3.3 | 100.71,7.49 101.73,8.51 101.73,12.57 100.71,13.59
SDI
  Top 0.203: IC5.5 62.48,24.02
  Top 0.29: 44.32,21.72 62.51,21.72 IC5.5
  Top 0.305: IC1.6 43.56,22.48 44.32,21.72
SDO  (via drill 0.6)  (2 unrouted)
  Top 0.203: IC5.6 62.99,24.03
  Top 0.29: 53.34,21.08 63.01,21.08 IC5.6
  Top 0.3: IC8.4 69.6,17.02 68.2,18.41 65.53,18.41 64.9,19.05 55.63,19.05 55.25,18.67 54.17,18.67 R41.1
  Top 0.305: IC1.7 42.29,21.84 43.05,21.08 53.34,21.08 v53.34,20.57 | IC14.4 73.41,4.83 73.66,5.08 73.66,10.92 | 73.66,10.92 IC11.4 | 73.66,10.92 73.66,16.76 73.41,17.02 IC8.4
  Bottom 0.3: v53.34,20.57 54.1,19.81 R41.1
  Bottom 0.305: R41.1 53.72,18.98
  other vias: 54.1,18.54
SDO_5V  (via drill 0.6)
  Top 0.305: IC18.6 v99.06,6.1 99.06,1.91 98.81,1.65 70.61,1.65 59.94,1.65 59.31,2.29 Q6.3 | v99.57,12.19 IC17.6 | v99.06,18.29 IC15.6
  Bottom 0.305: 99.06,12.19 v99.06,18.29 | 99.06,12.19 v99.57,12.19 | v99.06,6.1 99.06,12.19
  Bottom 0.406: R50.1 99.31,12.32 v99.57,12.19
STX  (via drill 0.6)
  Top 0.279: 80.9,31.12 v83.82,31.12 | v87,31.12 89.62,31.12 IC3.4
  Top 0.3: IC5.23 79.13,29.35 80.9,31.12
  Bottom 0.279: v83.82,31.12 v87,31.12
STY  (via drill 0.6)
  Top 0.279: IC5.22 71.86,28.85 72.14,28.58 v82.04,28.58 | v98.68,28.58 100.55,28.58 IC4.4
  Bottom 0.279: v82.04,28.58 v98.68,28.58
STZ  (via drill 0.6)
  Top 0.279: IC5.21 71.47,28.35 73.15,26.67 80.9,26.67 v81.66,25.91 | v88.14,24.77 88.65,24.26 v95,24.26 | v107.06,25.53 109.22,23.37 CONN1.T2
  Bottom 0.279: v81.66,25.91 83.31,24.26 87.63,24.26 v88.14,24.77 | v95,24.26 96.27,25.53 v107.06,25.53
  other vias: 113.16,23.37
TPIN+1  (via drill 0.6)  (2 unrouted)
  Top 0.61: IC1.13 34.67,22.48 33.91,21.72 31.24,21.72 29.46,23.49 IC2.6 R4.2
  other vias: 26.29,23.49
TPIN+2
  Top 0.508: J1.3 12.22,21.72 14.13,23.62 17.78,23.62 17.91,23.49 IC2.11
TPIN-1  (via drill 0.6)  (2 unrouted)
  Top 0.61: IC1.12 35.94,25.15 35.05,26.03 IC2.8 R3.2
  other vias: 26.29,26.03
TPIN-2
  Top 0.508: IC2.9 10.57,26.03 10.06,25.53 10.06,17.91 10.7,17.27 J1.6
TPOUT+1
  Top 0.61: 31.62,13.72 31.62,12.06 32.26,11.43 35.43,11.43 35.94,11.94 IC1.17 | 31.62,13.72 31.62,16.64 31.12,17.14 IC2.1 | 31.62,13.72 R1.2
TPOUT+2
  Top 0.508: IC2.16 16.54,17.14 16.29,17.4 16.29,18.29 16.03,18.54 14,18.54 12.99,19.81 11.46,19.81 10.95,20.32 10.95,23.24 11.34,23.62 J1.1
TPOUT-1  (via drill 0.6)
  Top 0.61: IC2.3 v32.77,19.69 34.67,17.78 IC1.16
  Bottom 0.61: R2.2 32.45,20 v32.77,19.69
TPOUT-2
  Top 0.508: IC2.14 16.8,19.69 16.54,19.94 16.54,22.1 16.29,22.35 J1.2
VREF+5V  (via drill 0.6)
  Top 0.6: v77.85,30.48 85.09,37.72 C57.+
  Bottom 0.6: FB8.1 74.42,27.05 v77.85,30.48
  Bottom 0.61: C55.1 84.9,40.77 FB9.2 C57.+
X  (1 unrouted)
  Top 0.25: 69.22,23.88 68.58,23.24 67.69,23.24 67.51,23.42 IC5.15
  Top 0.279: 79.52,23.86 79.5,23.88 | R35.2 79.48,23.88
  Top 0.4: 79.48,23.88 69.22,23.88
X_VCC_5V  (via drill 0.6)  (3 unrouted)
  Top 0.29: C28.1 97.19,32.53 | 96.43,30.53 96.39,30.57
  Top 0.6: 96.39,30.57 IC4.7 97.28,32.77 97.66,33.15 101.73,33.15 102.11,33.53 C61.+ | IC4.8 96.43,30.53
  Bottom 0.61: C59.1 101.92,40.77 FB2.2 C61.+
  other vias: 97.16,32.51
XAMP
  Top 0.279: 80.88,22.37 R35.1
  Top 0.4: 85.36,20.83 IC15.1 | 81.66,21.59 80.88,22.37
  Top 0.406: 81.66,21.59 83.65,21.59 arc-90 D1.3 84.64,21.55 85.36,20.83
Y  (via drill 0.6)
  Top 0.25: 67.18,22.61 67.01,22.78 IC5.14
  Top 0.4: v80.9,19.56 80.9,20.45 78.11,23.24 69.85,23.24 69.22,22.61 67.18,22.61
  Bottom 0.4: v80.9,19.56 R36.2
Y_VCC_5V  (via drill 0.6)  (1 unrouted)
  Top 0.29: 112.58,17.97 v112.9,18.29 CONN1.T4
  Top 0.6: C31.1 112.58,17.97 | C65.+ 110.62,37.08 109.98,36.45 107.19,36.45 106.93,36.2 106.93,28.32 v110.11,25.15
  Bottom 0.29: v112.9,18.29 112.27,18.29
  Bottom 0.6: v110.11,25.15 110.74,24.51 110.74,19.81 112.27,18.29
  Bottom 0.61: C63.1 110.42,40.77 FB3.2 C65.+
YAMP  (via drill 0.6)  (2 unrouted)
  Top 0.279: R36.1 80.96,16.38
  Top 0.4: IC17.1 86,14.73
  Top 0.406: 86,14.73 84.77,15.96 D3.3 81.26,15.96 R36.1
  other vias: 80.9,16.26
Z  (via drill 0.6)
  Top 0.25: 66.51,22.13 IC5.13
  Top 0.4: v77.85,22.1 77.6,22.35 76.71,22.35 73.15,22.35 73.03,22.48 70.36,22.48 69.85,21.97 66.68,21.97 66.51,22.13
  Bottom 0.4: R37.2 80.77,14.22 80.39,14.61 78.99,14.61 78.74,14.86 78.74,21.21 v77.85,22.1
Z_VCC_5V  (via drill 0.6)  (1 unrouted)
  Top 0.279: IC3.8 90.17,26.03
  Top 0.6: IC3.8 89.32,27.18 IC3.7 v85.73,27.18 | C49.+ 93.6,31.62 94.23,30.99 94.23,26.54 93.73,26.03 90.17,26.03
  Bottom 0.61: C34.1 93.41,40.77 FB5.2 C49.+
ZAMP  (via drill 0.6)  (2 unrouted)
  Top 0.279: R37.1 80.83,10.29
  Top 0.4: IC18.1 86.12,8.64
  Top 0.406: 86.12,8.64 84.77,9.99 D4.3 83.46,10.23 R37.1
  other vias: 80.77,10.16